# Altium project 2312_BadgePlaceTravail.PrjPcb (part 1 of 2)
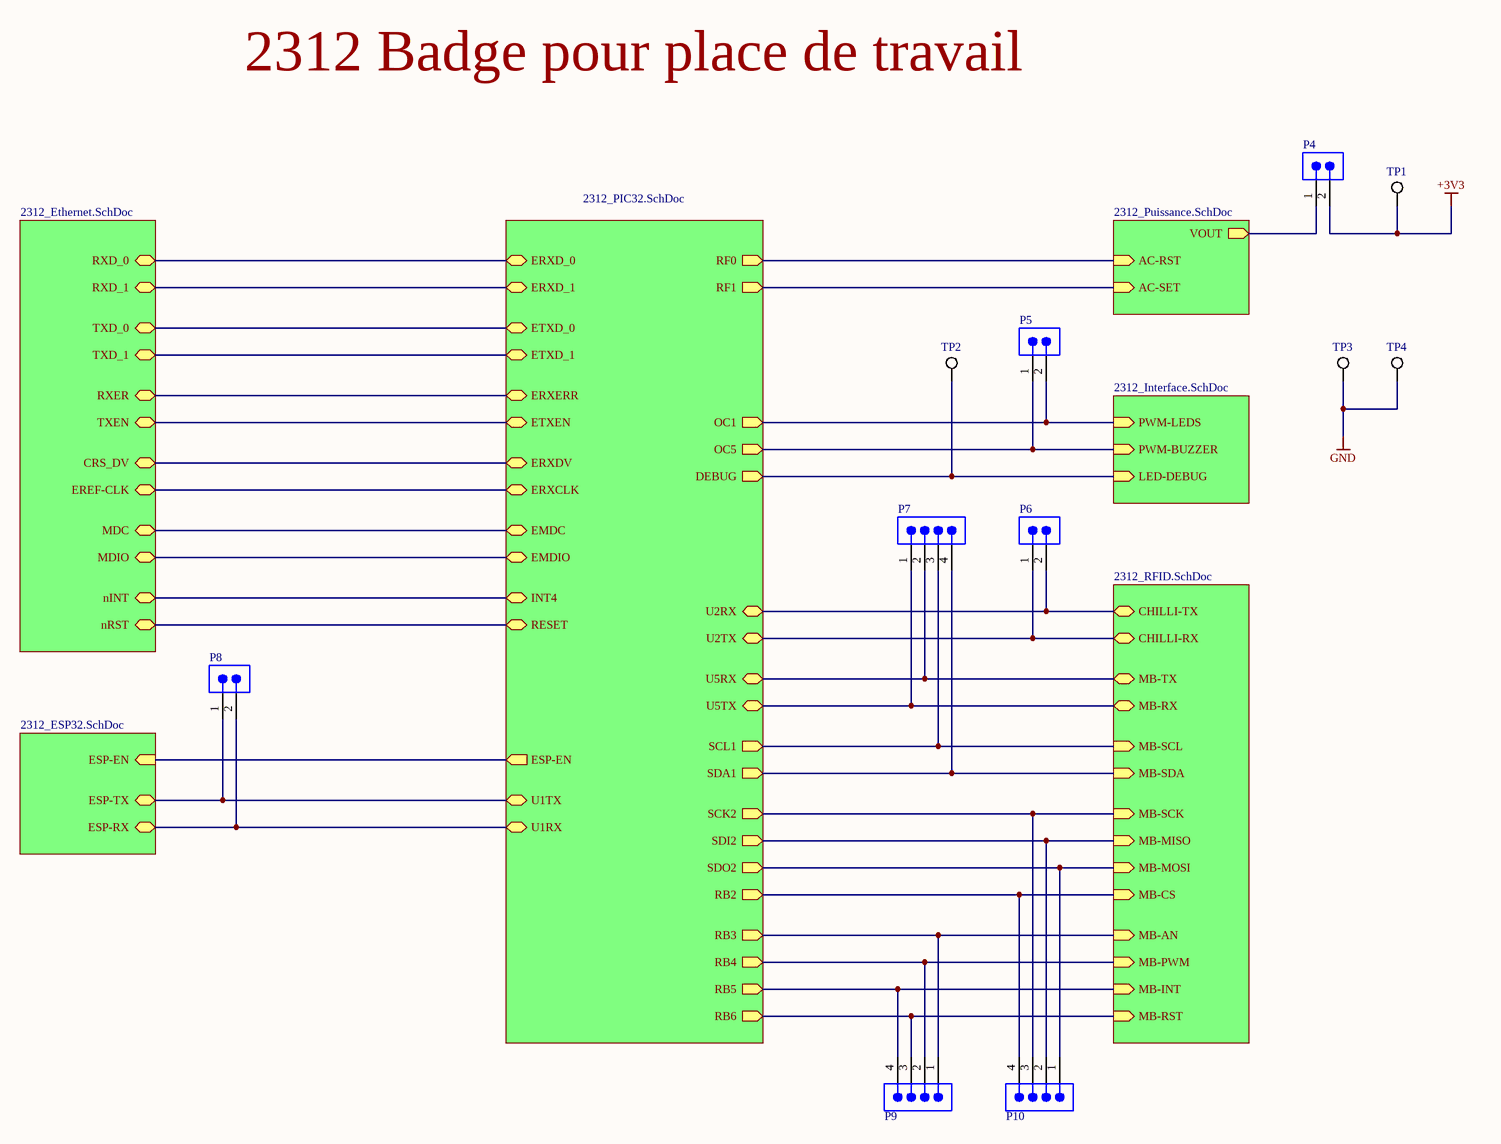
[diagram p0: 2312_SchemaBloc.SchDoc]
7 sheets, 119 parts. Net scope: hierarchical (ports join the sheet entries above them; power ports are global).
Board file: 2312_BadgePlaceTravail.PcbDoc
Sheets:
  2312_SchemaBloc.SchDoc
    Puissance = 2312_Puissance.SchDoc
    Microcontrôleur = 2312_PIC32.SchDoc
    Interface = 2312_Interface.SchDoc
    Ethernet = 2312_Ethernet.SchDoc
    Communication = 2312_RFID.SchDoc
    ESP32 = 2312_ESP32.SchDoc

## Sheet 2312_SchemaBloc.SchDoc
size A3; Author: Miguel Santos; Organization: ETML-ES; Address1: Avenue Recordon 1; Address2: 1004 Lausanne; Address3: Switzerland; SheetNumber: 1; SheetTotal: 7; Version: 1.0

### Parts
P4  61300211121  [61300211121]  (value not drawn)
P5  61300211121  [61300211121]  (value not drawn)
P6  61300211121  [61300211121]  (value not drawn)
P7  61300411121  [61300411121]  (value not drawn)
P8  61300211121  [61300211121]  (value not drawn)
P9  61300411121  [61300411121]  (value not drawn)
P10  61300411121  [61300411121]  (value not drawn)
TP1  5019  [KSTN-5019_V]  (value not drawn)
TP2  5019  [KSTN-5019_V]  (value not drawn)
TP3  5019  [KSTN-5019_V]  (value not drawn)
TP4  5019  [KSTN-5019_V]  (value not drawn)

### Sub-sheets
Communication = 2312_RFID.SchDoc: MB-AN (in), MB-RST (in), MB-CS (in), MB-SCK (in), MB-MISO (in), MB-MOSI (in), MB-PWM (in), MB-INT (in), MB-RX (bidir), MB-TX (bidir), MB-SCL (in), MB-SDA (in), CHILLI-RX (bidir), CHILLI-TX (bidir)
ESP32 = 2312_ESP32.SchDoc: ESP-RX (bidir), ESP-EN (in), ESP-TX (bidir)
Ethernet = 2312_Ethernet.SchDoc: CRS_DV (bidir), MDIO (bidir), MDC (bidir), nRST (bidir), RXER (bidir), RXD_0 (bidir), RXD_1 (bidir), nINT (bidir), TXEN (bidir), TXD_0 (bidir), TXD_1 (bidir), EREF-CLK (bidir)
Interface = 2312_Interface.SchDoc: PWM-BUZZER (in), PWM-LEDS (in), LED-DEBUG (in)
Microcontrôleur = 2312_PIC32.SchDoc: ETXEN (bidir), ETXD_0 (bidir), ETXD_1 (bidir), U5RX (bidir), U5TX (bidir), EMDC (bidir), U2RX (bidir), U2TX (bidir), SDA1 (out), SCL1 (out), INT4 (bidir), OC1 (out), EMDIO (bidir), U1RX (bidir), U1TX (bidir), OC5 (out), RF0 (out), RF1 (out), ERXD_1 (bidir), ERXD_0 (bidir), ERXDV (bidir), ERXERR (bidir), RB3 (out), RB4 (out), RB5 (out), RB6 (out), ESP-EN (out), RB2 (out), SCK2 (out), SDI2 (out), SDO2 (out), RESET (bidir), ERXCLK (bidir), DEBUG (out)
Puissance = 2312_Puissance.SchDoc: VOUT (out), AC-SET (in), AC-RST (in)

### Nets
+3V3: P4.2 TP1.1
GND: TP3.1 TP4.1
AC-RST: sheet Puissance/AC-RST, sheet Microcontrôleur/RF0
AC-SET: sheet Puissance/AC-SET, sheet Microcontrôleur/RF1
CHILLI-RX: P6.1 ; sheet Microcontrôleur/U2TX, sheet Communication/CHILLI-RX
CHILLI-TX: P6.2 ; sheet Microcontrôleur/U2RX, sheet Communication/CHILLI-TX
CRS_DV: sheet Microcontrôleur/ERXDV, sheet Ethernet/CRS_DV
DEBUG: TP2.1 ; sheet Microcontrôleur/DEBUG, sheet Interface/LED-DEBUG
EMDC: sheet Microcontrôleur/EMDC, sheet Ethernet/MDC
EMDIO: sheet Microcontrôleur/EMDIO, sheet Ethernet/MDIO
EN: sheet Microcontrôleur/ESP-EN, sheet ESP32/ESP-EN
EREF-CLK: sheet Microcontrôleur/ERXCLK, sheet Ethernet/EREF-CLK
ERXD_0: sheet Microcontrôleur/ERXD_0, sheet Ethernet/RXD_0
ERXD_1: sheet Microcontrôleur/ERXD_1, sheet Ethernet/RXD_1
ERXERR: sheet Microcontrôleur/ERXERR, sheet Ethernet/RXER
ETXD_0: sheet Microcontrôleur/ETXD_0, sheet Ethernet/TXD_0
ETXD_1: sheet Microcontrôleur/ETXD_1, sheet Ethernet/TXD_1
ETXEN: sheet Microcontrôleur/ETXEN, sheet Ethernet/TXEN
INT4: sheet Microcontrôleur/INT4, sheet Ethernet/nINT
IO6: P8.2 ; sheet Microcontrôleur/U1RX, sheet ESP32/ESP-RX
IO7: P8.1 ; sheet Microcontrôleur/U1TX, sheet ESP32/ESP-TX
MB-AN: P9.1 ; sheet Microcontrôleur/RB3, sheet Communication/MB-AN
MB-CS: P10.4 ; sheet Microcontrôleur/RB2, sheet Communication/MB-CS
MB-INT: P9.4 ; sheet Microcontrôleur/RB5, sheet Communication/MB-INT
MB-MISO: P10.2 ; sheet Microcontrôleur/SDI2, sheet Communication/MB-MISO
MB-MOSI: P10.1 ; sheet Microcontrôleur/SDO2, sheet Communication/MB-MOSI
MB-PWM: P9.2 ; sheet Microcontrôleur/RB4, sheet Communication/MB-PWM
MB-RST: P9.3 ; sheet Microcontrôleur/RB6, sheet Communication/MB-RST
MB-RX: P7.1 ; sheet Microcontrôleur/U5TX, sheet Communication/MB-RX
MB-SCK: P10.3 ; sheet Microcontrôleur/SCK2, sheet Communication/MB-SCK
MB-SCL: P7.3 ; sheet Microcontrôleur/SCL1, sheet Communication/MB-SCL
MB-SDA: P7.4 ; sheet Microcontrôleur/SDA1, sheet Communication/MB-SDA
MB-TX: P7.2 ; sheet Microcontrôleur/U5RX, sheet Communication/MB-TX
nRST: sheet Microcontrôleur/RESET, sheet Ethernet/nRST
OC1: P5.2 ; sheet Microcontrôleur/OC1, sheet Interface/PWM-LEDS
OC5: P5.1 ; sheet Microcontrôleur/OC5, sheet Interface/PWM-BUZZER
VOUT: P4.1 ; sheet Puissance/VOUT

### Notes on the sheet
- 2312 Badge pour place de travail
- Fichier :
- a
- Date :
- Heure :
- Version :
- Auteur :
- Modif.
- b
- c
- d
- Projet :
- No :
- Nb feuilles
- Feuille n°
- Chemin :

### Library data of the parts
P4-P6 P8 = 61300211121: WR-PHD Pin Header, THT, Vertical, pitch 2.54mm, 1 Row, 2P; Manufacturer: Wurth Elektronik; Contact Resistance: 20mΩ; Rated Current: 3A; Working Voltage: 250V; Withstanding Voltage: 500V; ComponentLink1Description: Website Link; ComponentLink1URL: https://www.we-online.com/redexpert/article/61300211121?ad; ComponentLink2Description: Datasheet Link; ComponentLink2URL: https://www.we-online.com/redexpert/spec/61300211121?ad; Manufacturer Part Number: 61300211121; Category: Board-to-Board Connectors; Match Code: WR-PHD; Mount: Through Hole; Operating Temperature Max: 105°C; Operating Temperature Min: -40°C; Packaging: Bag; Gender: Pin Header; Number of Pins: 2; Number of Rows: 1; Orientation: Vertical; Pitch: 2.54mm
P7 P9 P10 = 61300411121: WR-PHD Pin Header, THT, Vertical, pitch 2.54mm, 1 Row, 4P; Manufacturer: Wurth Elektronik; Contact Resistance: 20mΩ; Rated Current: 3A; Working Voltage: 250V; Withstanding Voltage: 500V; ComponentLink1Description: Website Link; ComponentLink1URL: https://www.we-online.com/redexpert/article/61300411121?ad; ComponentLink2Description: Datasheet Link; ComponentLink2URL: https://www.we-online.com/redexpert/spec/61300411121?ad; Manufacturer Part Number: 61300411121; Category: Board-to-Board Connectors; Match Code: WR-PHD; Mount: Through Hole; Operating Temperature Max: 105°C; Operating Temperature Min: -40°C; Packaging: Bag; Gender: Pin Header; Number of Pins: 4; Number of Rows: 1; Orientation: Vertical; Pitch: 2.54mm
TP1-TP4 = CMP-1672-00008-1: Test Point, 1 Position SMD, RoHS, Tape and Reel; ComponentLink1Description: Manufacturer URL; Package Quantity: 1000; DatasheetVersion: 03/2014; Packaging: Tape and Reel; ComponentLink2URL: http://www.keyelco.com/product-pdf.cfm?p=1357; ComponentLink1URL: http://www.keyelco.com/; Mount: Surface Mount; Contact Plating: Silver; PackageDescription: 1-Pin Surface Mount Device, Body 3.81 x 2.03 mm; Pins: 1; RoHSCompliant: True; Mounting Technology: Surface Mount; ComponentLink2Description: Datasheet; PackageReference: 5019

## Sheet 2312_Puissance.SchDoc
size A3; Author: Miguel Santos; Organization: ETML-ES; Address1: Avenue Recordon 1; Address2: 1004 Lausanne; Address3: Switzerland; SheetNumber: 2; SheetTotal: 7; Version: 1.0
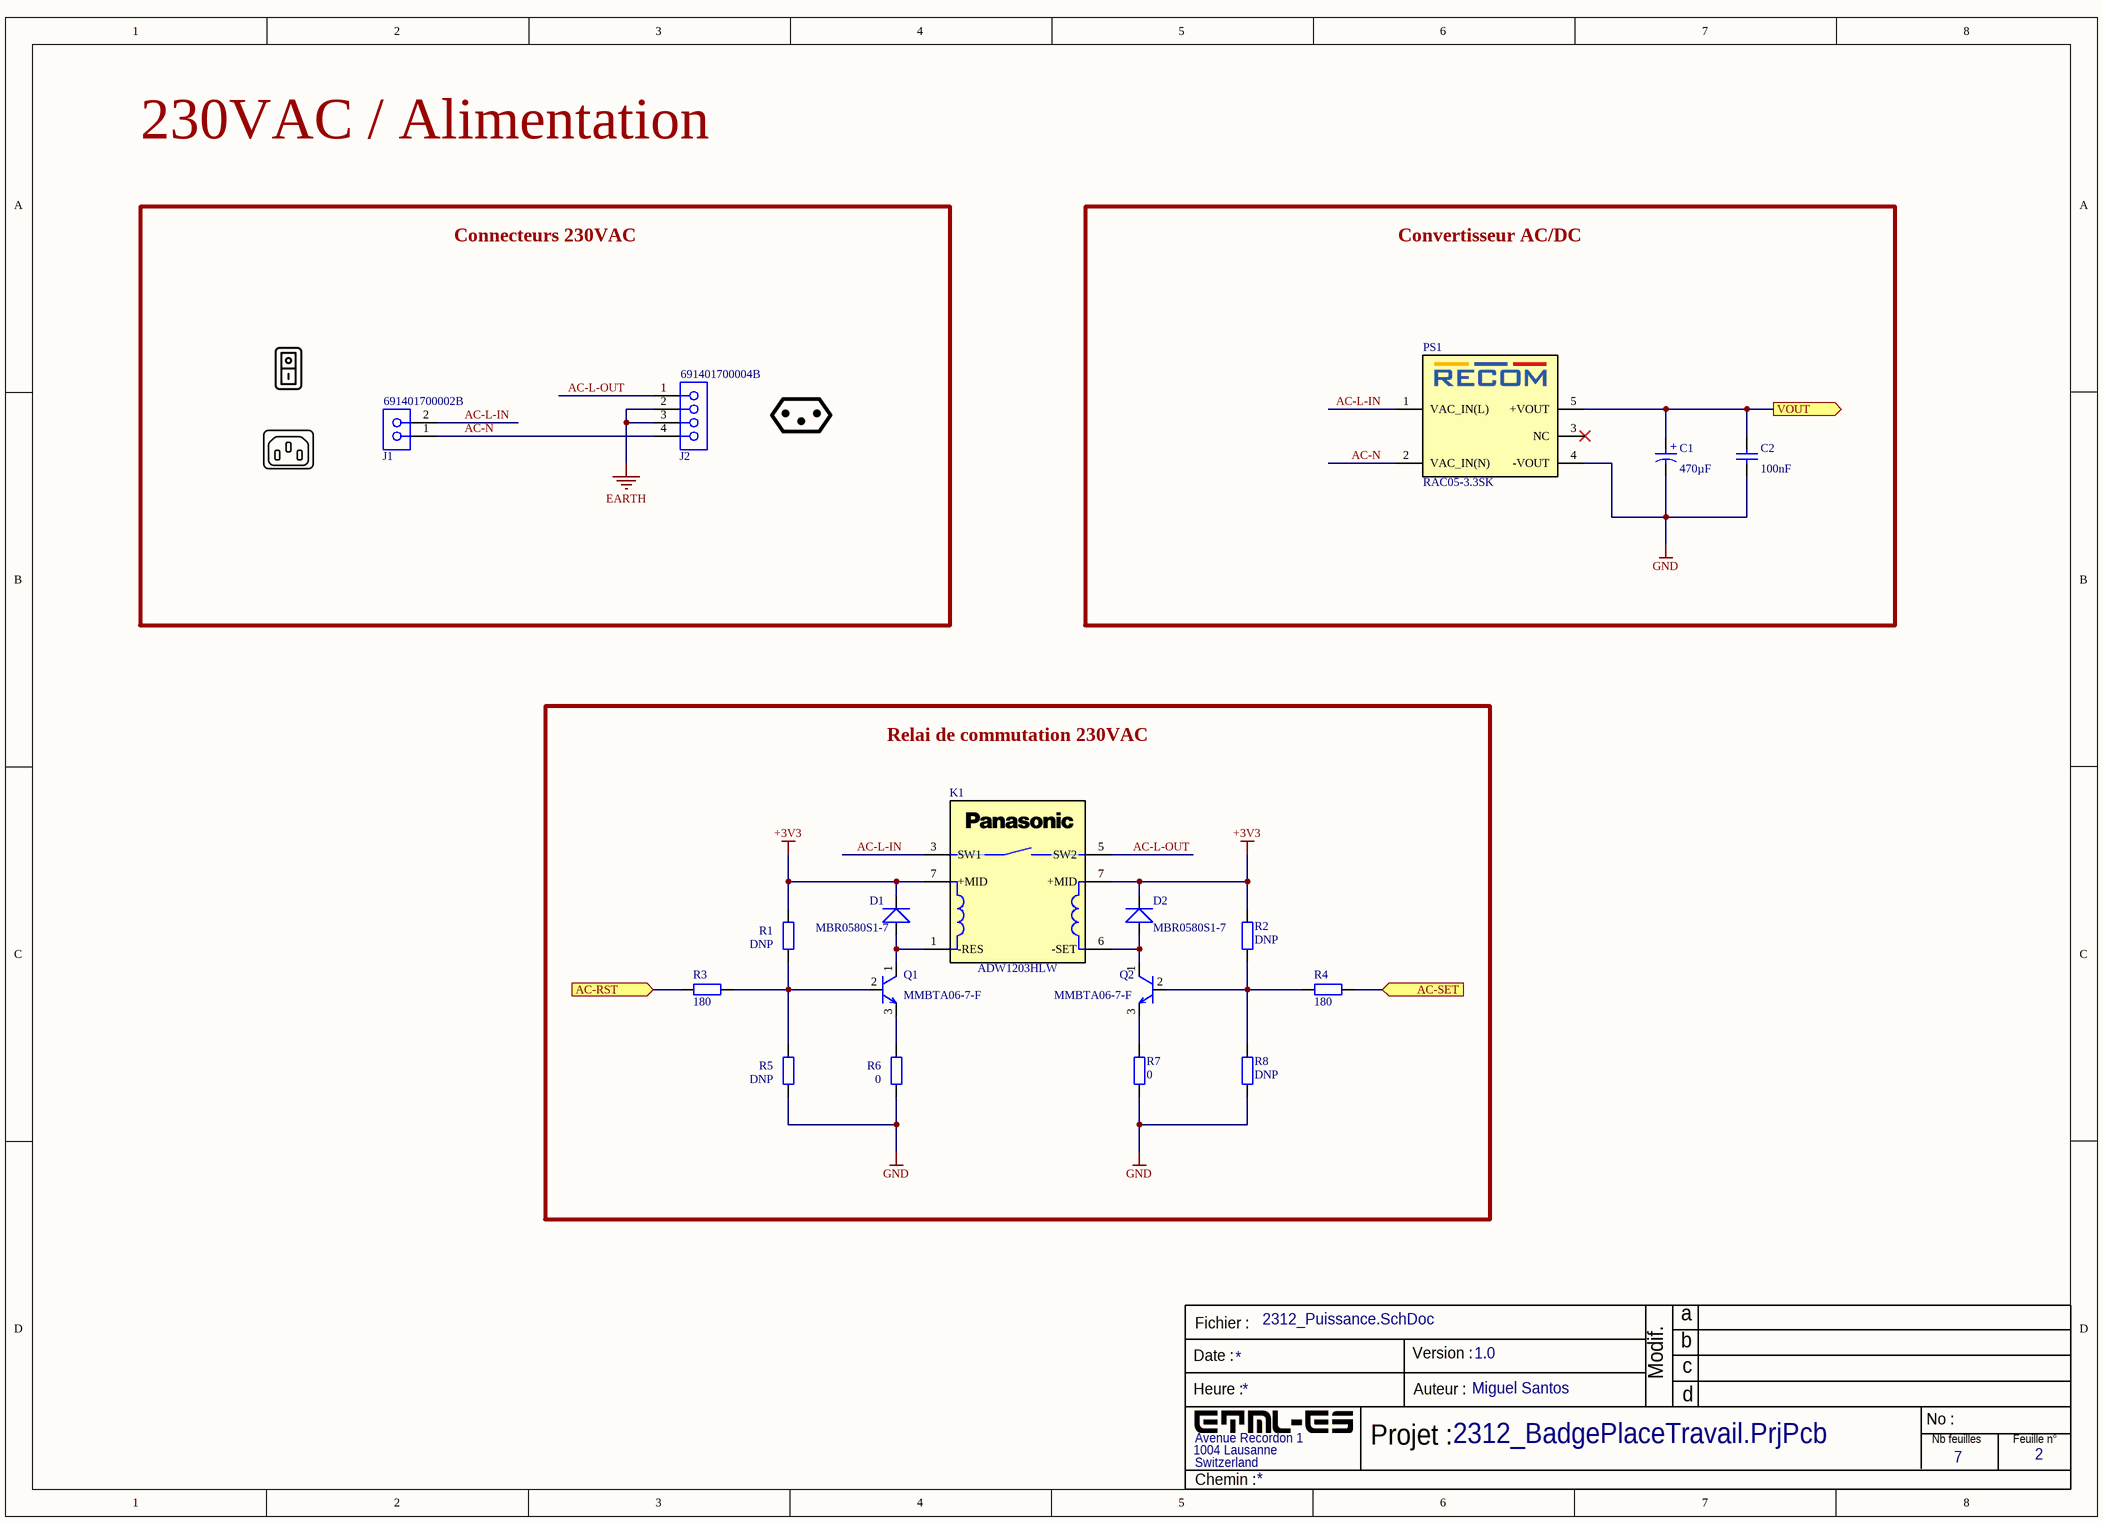
[diagram p1: 2312_Puissance.SchDoc]

### Parts
C1  Capacitance: 470µF  [WCAP-PSHP_D8H7.7]  (hidden comment: 875115150005)
C2  Capacitance: 100nF  [WCAP-CSGP_0805_L2W1.25H0.8_Reflow]  (hidden comment: 885012207016)
D1  MBR0580S1-7  [MBR0580S1-7_DIO-M]
D2  MBR0580S1-7  [MBR0580S1-7_DIO-M]
J1  691401700002B  [691401700002B]
J2  691401700004B  [691401700004B]
K1  ADW1203HLW  [ADW1203HLW]
PS1  RAC05-3.3SK  [CONV_RAC05-3.3SK]
Q1  MMBTA06-7-F  [SOT91P240X120-3N]
Q2  MMBTA06-7-F  [SOT91P240X120-3N]
R1  Resistance: DNP  [2312-RES-0805]  (hidden comment: RES-0805)
R2  Resistance: DNP  [2312-RES-0805]  (hidden comment: RES-0805)
R3  Resistance: 180  [2312-RES-0805]  (hidden comment: RES-0805)
R4  Resistance: 180  [2312-RES-0805]  (hidden comment: RES-0805)
R5  Resistance: DNP  [2312-RES-0805]  (hidden comment: RES-0805)
R6  Resistance: 0  [2312-RES-0805]  (hidden comment: RES-0805)
R7  Resistance: 0  [2312-RES-0805]  (hidden comment: RES-0805)
R8  Resistance: DNP  [2312-RES-0805]  (hidden comment: RES-0805)

### Blocks framed on the sheet
Connecteurs 230VAC: J1 J2
Convertisseur AC/DC: C1 C2 PS1
Relai de commutation 230VAC: D1 D2 K1 Q1 Q2 R1-R8

### Ports
AC-RST (in), AC-SET (in), VOUT (out)

### Nets
+3V3: D1.2 D2.2 K1.7(+MID) R1.2 R2.2
EARTH: J2.2 J2.3
GND: C1.2(N) C2.1 PS1.4(-VOUT) R5.1 R6.1 R7.1 R8.1
AC-L-IN: J1.2 K1.3(SW1) PS1.1(VAC_IN(L))
AC-L-OUT: J2.1 K1.5(SW2)
AC-N: J1.1 J2.4 PS1.2(VAC_IN(N))
AC-RST: R3.2 ; port AC-RST
AC-SET: R4.1 ; port AC-SET
VOUT: C1.1(P) C2.2 PS1.5(+VOUT) ; port VOUT
NetD1_1: D1.1 K1.1(-RES) Q1.1(COLLECTOR)
NetD2_1: D2.1 K1.6(-SET) Q2.1(COLLECTOR)
NetQ1_2: Q1.2(BASE) R1.1 R3.1 R5.2
NetQ1_3: Q1.3(EMITTER) R6.2
NetQ2_2: Q2.2(BASE) R2.1 R4.2 R8.2
NetQ2_3: Q2.3(EMITTER) R7.2

Not connected (* = marked no-connect by the designer): PS1 3(NC)*

### Notes on the sheet
- 230VAC / Alimentation
- Fichier :
- a
- Date :
- Heure :
- Version :
- Auteur :
- Modif.
- b
- c
- d
- Projet :
- No :
- Nb feuilles
- Feuille n°
- Chemin :
- (in symbol 875115150005) +

### Library data of the parts
C1 = 875115150005: WCAP-PSHP Aluminum Polymer Capacitor, V-Chip, SMT, D8 x H7.7mm, 470µF, 6.3V; Manufacturer: Wurth Elektronik; Capacitance Tolerance: +/-20%; Dissipation Factor: 8%; Endurance: 2000h; ESR: 20mΩ; Leakage Current: 592µA; Ripple Current: 3500mA; Technical Reference: PSEE077471M6R3DVCTDB000; Manufacturer Part Number: 875115150005; Category: Aluminum Polymer Capacitors; Match Code: WCAP-PSHP; ComponentLink1Description: Website Link; ComponentLink1URL: https://www.we-online.com/redexpert/article/875115150005?ad; ComponentLink2Description: Datasheet Link; ComponentLink2URL: https://www.we-online.com/redexpert/spec/875115150005?ad; Mount: Surface Mount; Operating Temperature Max: 105°C; Operating Temperature Min: -55°C; Packaging: Tape and Reel; Height: 7.7mm; Diameter: 8mm; Rated Voltage (DC): 6.3V
C2 = 885012207016: WCAP-CSGP Multilayer Ceramic Chip Capacitor, General Purpose, size 0805, X7R, 100nF, 10VDC; Manufacturer: Wurth Elektronik; Case/Size Code: 0805; Capacitance Tolerance: +/-10%; Dissipation Factor: 5%; Insulation Resistance: 5GΩ; Rated Voltage (DC): 10V; Technical Reference: X7R0805104K010DFCT10000; Manufacturer Part Number: 885012207016; Category: Multilayer Ceramic Chip Capacitors; Match Code: WCAP-CSGP; ComponentLink1Description: Website Link; ComponentLink1URL: https://www.we-online.com/redexpert/article/885012207016?ad; ComponentLink2Description: Datasheet Link; ComponentLink2URL: https://www.we-online.com/redexpert/spec/885012207016?ad; Mount: Surface Mount; Operating Temperature Max: 125°C; Operating Temperature Min: -55°C; Packaging: Tape and Reel; Length: 2mm; Width: 1.25mm; Height: 0.8mm; Ceramic Type: X7R
D1 D2 = MBR0580S1-7: Diode Shottky, 500mA, 80V; Mfr_Name: Diodes Inc; Digi-Key_Part_Number_3: MBR0580S1-7DIDKR-ND; Digi-Key_Part_Number_2: MBR0580S1-7DICT-ND; Digi-Key_Part_Number_1: MBR0580S1-7DITR-ND; RefDes: RefDes; Type: Type
J1 = 691401700002B: WR-TBL Series 401B Vertical Entry, THT, pitch 5mm, 2p; Manufacturer: Wurth Elektronik; Modularity: No; Rated Current: 10A; Working Voltage: 300V; ComponentLink1Description: Website Link; ComponentLink1URL: https://www.we-online.com/redexpert/article/691401700002B?ad; ComponentLink2Description: Datasheet Link; ComponentLink2URL: https://www.we-online.com/redexpert/spec/691401700002B?ad; Manufacturer Part Number: 691401700002B; Category: Terminal Blocks; Match Code: WR-TBL; Mount: Through Hole; Operating Temperature Max: 105°C; Operating Temperature Min: -40°C; Packaging: Box; Application: Screwless; Number of Pins: 2; Number of Rows: 1; Orientation: Vertical; Pitch: 5mm
J2 = 691401700004B: WR-TBL Series 401B Vertical Entry, THT, pitch 5mm, 4p; Manufacturer: Wurth Elektronik; Modularity: No; Rated Current: 10A; Working Voltage: 300V; ComponentLink1Description: Website Link; ComponentLink1URL: https://www.we-online.com/redexpert/article/691401700004B?ad; ComponentLink2Description: Datasheet Link; ComponentLink2URL: https://www.we-online.com/redexpert/spec/691401700004B?ad; Manufacturer Part Number: 691401700004B; Category: Terminal Blocks; Match Code: WR-TBL; Mount: Through Hole; Operating Temperature Max: 105°C; Operating Temperature Min: -40°C; Packaging: Box; Application: Screwless; Number of Pins: 4; Number of Rows: 1; Orientation: Vertical; Pitch: 5mm
K1 = ADW1203HLW: RELAY GEN PURPOSE SPST 16A 3V; Manufacturer: Panasonic Electric Works; Rated Current: 16A; Manufacturer Part Number: ADW1203HLW; Working Voltage: 3V
PS1 = RAC05-3.3SK: 5W AC/DC-Converter 'POWERLINE' 1x1 4kV reg; MF: Recom Power; Value: *; Package: DIP-5 Recom Power; MP: RAC05-3.3SK; Price: None; SnapEDA_Link: https://www.snapeda.com/parts/RAC05-3.3SK/Recom%20Power/view-part/2834355/?ref=snap; Availability: Unavailable
Q1 Q2 = MMBTA06LT3G: Bipolar (BJT) Transistor NPN 80V 500mA 100MHz 225mW Surface Mount SOT-23-3 (TO-236)
R1 R8 = RES-0805: SMD Resistor 0805, 1.4kΩ
R2 R5 = RES-0805: SMD Resistor 0805, DNP
R3 R4 = RES-0805: SMD Resistor 0805, 140Ω
R6 R7 = RES-0805: SMD Resistor 0805, 2Ω

## Sheet 2312_PIC32.SchDoc
size A3; Author: Miguel Santos; Organization: ETML-ES; Address1: Avenue Recordon 1; Address2: 1004 Lausanne; Address3: Switzerland; SheetNumber: 3; SheetTotal: 7; Version: 1.0
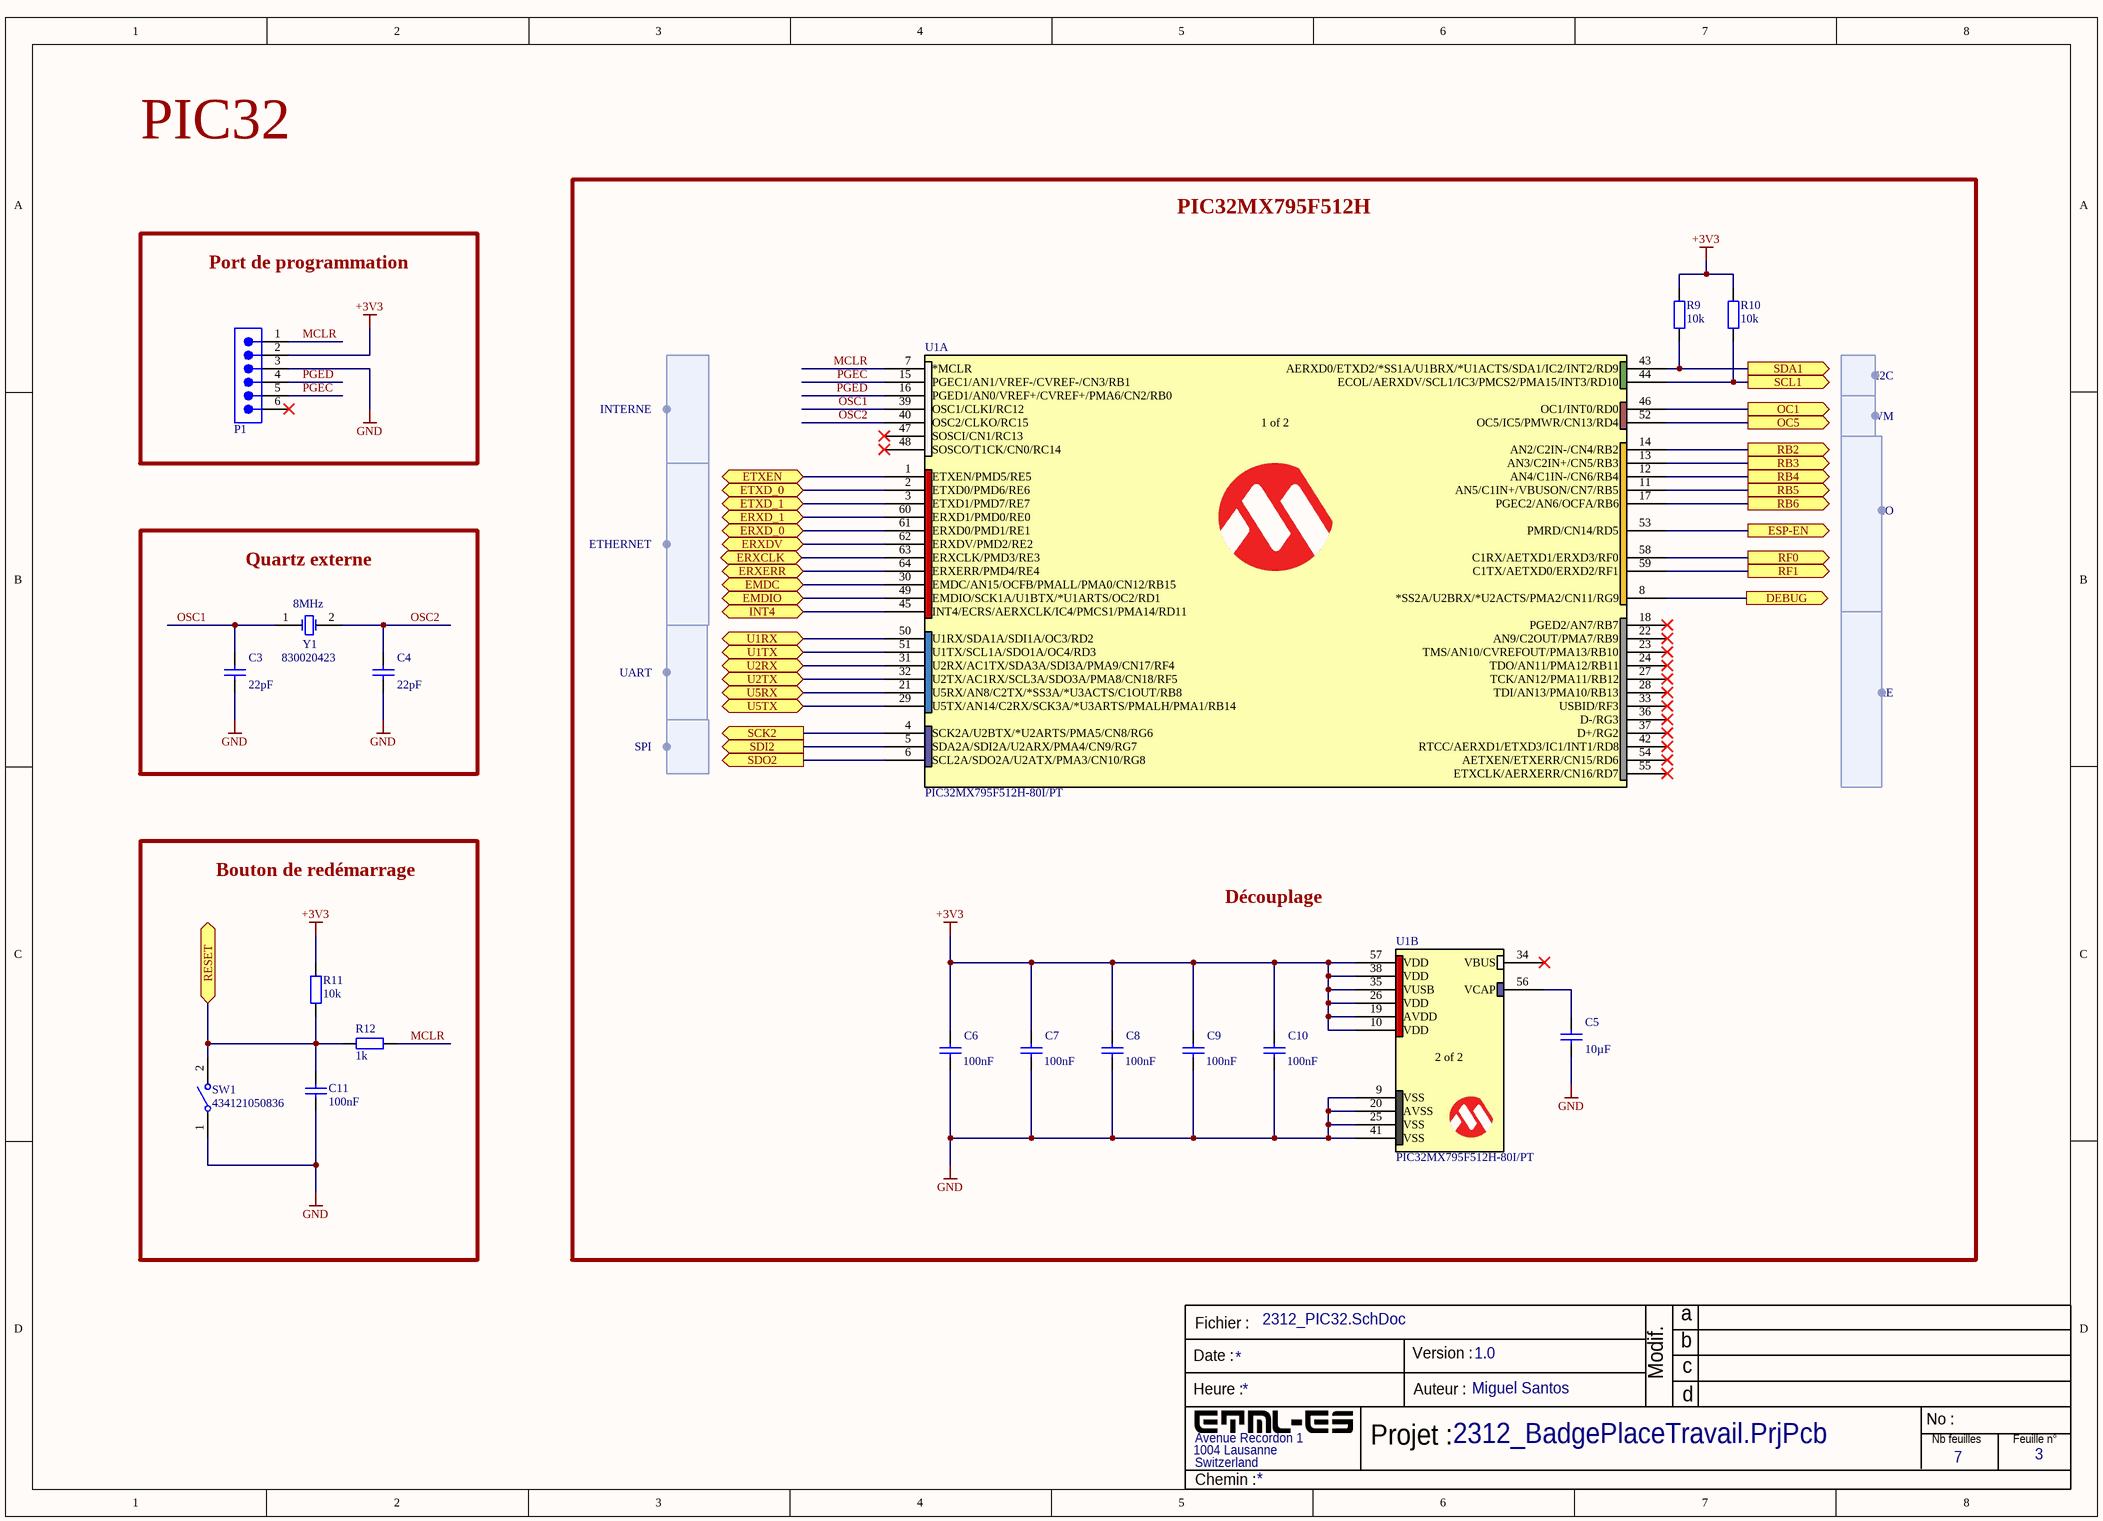
[diagram p2: 2312_PIC32.SchDoc]

### Parts
C3  Capacitance: 22pF  [WCAP-CSGP_0805_L2W1.25H0.6_Reflow]  (hidden comment: 885012007002)
C4  Capacitance: 22pF  [WCAP-CSGP_0805_L2W1.25H0.6_Reflow]  (hidden comment: 885012007002)
C5  Capacitance: 10µF  [WCAP-CSGP_0805_L2W1.25H1.25]  (hidden comment: 885012207003)
C6  Capacitance: 100nF  [WCAP-CSGP_0805_L2W1.25H0.8_Reflow]  (hidden comment: 885012207016)
C7  Capacitance: 100nF  [WCAP-CSGP_0805_L2W1.25H0.8_Reflow]  (hidden comment: 885012207016)
C8  Capacitance: 100nF  [WCAP-CSGP_0805_L2W1.25H0.8_Reflow]  (hidden comment: 885012207016)
C9  Capacitance: 100nF  [WCAP-CSGP_0805_L2W1.25H0.8_Reflow]  (hidden comment: 885012207016)
C10  Capacitance: 100nF  [WCAP-CSGP_0805_L2W1.25H0.8_Reflow]  (hidden comment: 885012207016)
C11  Capacitance: 100nF  [WCAP-CSGP_0805_L2W1.25H0.8_Reflow]  (hidden comment: 885012207016)
P1  61300611121  [61300611121]  (value not drawn)
R9  Resistance: 10k  [2312-RES-0805]  (hidden comment: RES-0805)
R10  Resistance: 10k  [2312-RES-0805]  (hidden comment: RES-0805)
R11  Resistance: 10k  [2312-RES-0805]  (hidden comment: RES-0805)
R12  Resistance: 1k  [2312-RES-0805]  (hidden comment: RES-0805)
SW1  434121050836  [WS-TASV_L6W3.5H5_4341x10508x6]
U1  PIC32MX795F512H-80I/PT  [TQFP64_10x10MC_MCH]  (parts A,B of 2)
Y1  830020423  Frequency: 8MHz  [WE-XTAL_HC49/4HSMX]

### Blocks framed on the sheet
PIC32MX795F512H: C5-C10 R9 R10 U1
Port de programmation: P1
Quartz externe: C3 C4 Y1
Bouton de redémarrage: C11 R11 R12 SW1

### Ports
DEBUG (out), EMDC (bidir), EMDIO (bidir), ERXCLK (bidir), ERXD_0 (bidir), ERXD_1 (bidir), ERXDV (bidir), ERXERR (bidir), ESP-EN (out), ETXD_0 (bidir), ETXD_1 (bidir), ETXEN (bidir), INT4 (bidir), OC1 (out), OC5 (out), RB2 (out), RB3 (out), RB4 (out), RB5 (out), RB6 (out), RESET (bidir), RF0 (out), RF1 (out), SCK2 (out), SCL1 (out), SDA1 (out), SDI2 (out), SDO2 (out), U1RX (bidir), U1TX (bidir), U2RX (bidir), U2TX (bidir), U5RX (bidir), U5TX (bidir)

### Harnesses
?: 

### Nets
+3V3: C6.2 C7.2 C8.2 C9.2 C10.2 P1.2 R9.2 R10.1 R11.1 U1.10(VDD) U1.19(AVDD) U1.26(VDD) U1.35(VUSB) U1.38(VDD) U1.57(VDD)
GND: C3.1 C4.2 C5.1 C6.1 C7.1 C8.1 C9.1 C10.1 C11.2 P1.3 SW1.1 U1.9(VSS) U1.20(AVSS) U1.25(VSS) U1.41(VSS)
AC-RST: U1.58(C1RX/AETXD1/ERXD3/RF0) ; port RF0
AC-SET: U1.59(C1TX/AETXD0/ERXD2/RF1) ; port RF1
CHILLI-RX: U1.32(U2TX/AC1RX/SCL3A/SDO3A/PMA8/CN18/RF5) ; port U2TX
CHILLI-TX: U1.31(U2RX/AC1TX/SDA3A/SDI3A/PMA9/CN17/RF4) ; port U2RX
CRS_DV: U1.62(ERXDV/PMD2/RE2) ; port ERXDV
DEBUG: U1.8(*SS2A/U2BRX/*U2ACTS/PMA2/CN11/RG9) ; port DEBUG
EMDC: U1.30(EMDC/AN15/OCFB/PMALL/PMA0/CN12/RB15) ; port EMDC
EMDIO: U1.49(EMDIO/SCK1A/U1BTX/*U1ARTS/OC2/RD1) ; port EMDIO
EN: U1.53(PMRD/CN14/RD5) ; port ESP-EN
EREF-CLK: U1.63(ERXCLK/PMD3/RE3) ; port ERXCLK
ERXD_0: U1.61(ERXD0/PMD1/RE1) ; port ERXD_0
ERXD_1: U1.60(ERXD1/PMD0/RE0) ; port ERXD_1
ERXERR: U1.64(ERXERR/PMD4/RE4) ; port ERXERR
ETXD_0: U1.2(ETXD0/PMD6/RE6) ; port ETXD_0
ETXD_1: U1.3(ETXD1/PMD7/RE7) ; port ETXD_1
ETXEN: U1.1(ETXEN/PMD5/RE5) ; port ETXEN
INT4: U1.45(INT4/ECRS/AERXCLK/IC4/PMCS1/PMA14/RD11) ; port INT4
IO6: U1.50(U1RX/SDA1A/SDI1A/OC3/RD2) ; port U1RX
IO7: U1.51(U1TX/SCL1A/SDO1A/OC4/RD3) ; port U1TX
MB-AN: U1.13(AN3/C2IN+/CN5/RB3) ; port RB3
MB-CS: U1.14(AN2/C2IN-/CN4/RB2) ; port RB2
MB-INT: U1.11(AN5/C1IN+/VBUSON/CN7/RB5) ; port RB5
MB-MISO: U1.5(SDA2A/SDI2A/U2ARX/PMA4/CN9/RG7) ; port SDI2
MB-MOSI: U1.6(SCL2A/SDO2A/U2ATX/PMA3/CN10/RG8) ; port SDO2
MB-PWM: U1.12(AN4/C1IN-/CN6/RB4) ; port RB4
MB-RST: U1.17(PGEC2/AN6/OCFA/RB6) ; port RB6
MB-RX: U1.29(U5TX/AN14/C2RX/SCK3A/*U3ARTS/PMALH/PMA1/RB14) ; port U5TX
MB-SCK: U1.4(SCK2A/U2BTX/*U2ARTS/PMA5/CN8/RG6) ; port SCK2
MB-SCL: R10.2 U1.44(ECOL/AERXDV/SCL1/IC3/PMCS2/PMA15/INT3/RD10) ; port SCL1
MB-SDA: R9.1 U1.43(AERXD0/ETXD2/*SS1A/U1BRX/*U1ACTS/SDA1/IC2/INT2/RD9) ; port SDA1
MB-TX: U1.21(U5RX/AN8/C2TX/*SS3A/*U3ACTS/C1OUT/RB8) ; port U5RX
MCLR: P1.1 R12.2 U1.7(*MCLR)
nRST: C11.1 R11.2 R12.1 SW1.2 ; port RESET
OC1: U1.46(OC1/INT0/RD0) ; port OC1
OC5: U1.52(OC5/IC5/PMWR/CN13/RD4) ; port OC5
OSC1: C3.2 U1.39(OSC1/CLKI/RC12) Y1.1(OSC1)
OSC2: C4.1 U1.40(OSC2/CLKO/RC15) Y1.2(OSC2)
PGEC: P1.5 U1.15(PGEC1/AN1/VREF-/CVREF-/CN3/RB1)
PGED: P1.4 U1.16(PGED1/AN0/VREF+/CVREF+/PMA6/CN2/RB0)
NetC5_2: C5.2 U1.56(VCAP)

Not connected (* = marked no-connect by the designer): P1 6*; U1 18(PGED2/AN7/RB7)* 22(AN9/C2OUT/PMA7/RB9)* 23(TMS/AN10/CVREFOUT/PMA13/RB10)* 24(TDO/AN11/PMA12/RB11)* 27(TCK/AN12/PMA11/RB12)* 28(TDI/AN13/PMA10/RB13)* 33(USBID/RF3)* 34(VBUS)* 36(D-/RG3)* 37(D+/RG2)* 42(RTCC/AERXD1/ETXD3/IC1/INT1/RD8)* 47(SOSCI/CN1/RC13)* 48(SOSCO/T1CK/CN0/RC14)* 54(AETXEN/ETXERR/CN15/RD6)* 55(ETXCLK/AERXERR/CN16/RD7)*

### Notes on the sheet
- PIC32
- I2C
- INTERNE
- PWM
- GPIO
- ETHERNET
- UART
- LIBRE
- SPI
- Découplage
- Fichier :
- a
- Date :
- Heure :
- Version :
- Auteur :
- Modif.
- b
- c
- d
- Projet :
- No :
- Nb feuilles
- Feuille n°
- Chemin :
- (in symbol PIC32MX795F512H-80I/PT, part A) 1 of 2
- (in symbol PIC32MX795F512H-80I/PT, part B) 2 of 2

### Library data of the parts
C3 C4 = 885012007002: WCAP-CSGP Multilayer Ceramic Chip Capacitor, General Purpose, size 0805, NP0, 22pF, 10VDC; Manufacturer: Wurth Elektronik; Case/Size Code: 0805; Capacitance Tolerance: +/-5%; Insulation Resistance: 10GΩ; Q Factor: 840; Rated Voltage (DC): 10V; Technical Reference: NP00805220J010DFCT10000; Manufacturer Part Number: 885012007002; Category: Multilayer Ceramic Chip Capacitors; Match Code: WCAP-CSGP; ComponentLink1Description: Website Link; ComponentLink1URL: https://www.we-online.com/redexpert/article/885012007002?ad; ComponentLink2Description: Datasheet Link; ComponentLink2URL: https://www.we-online.com/redexpert/spec/885012007002?ad; Mount: Surface Mount; Operating Temperature Max: 125°C; Operating Temperature Min: -55°C; Packaging: Tape and Reel; Length: 2mm; Width: 1.25mm; Height: 0.6mm; Ceramic Type: NP0
C5 = 885012207003: WCAP-CSGP Multilayer Ceramic Chip Capacitor, General Purpose, size 0805, X7R, 10µF, 6.3VDC; Manufacturer: Wurth Elektronik; Case/Size Code: 0805; Capacitance Tolerance: +/-10%; Dissipation Factor: 10%; Insulation Resistance: 0.01GΩ; Rated Voltage (DC): 6.3V; Technical Reference: X7R0805106K6R3DFCT10000; Manufacturer Part Number: 885012207003; Category: Multilayer Ceramic Chip Capacitors; Match Code: WCAP-CSGP; ComponentLink1Description: Website Link; ComponentLink1URL: https://www.we-online.com/redexpert/article/885012207003?ad; ComponentLink2Description: Datasheet Link; ComponentLink2URL: https://www.we-online.com/redexpert/spec/885012207003?ad; Mount: Surface Mount; Operating Temperature Max: 125°C; Operating Temperature Min: -55°C; Packaging: Tape and Reel; Length: 2mm; Width: 1.25mm; Height: 1.25mm; Ceramic Type: X7R
C6-C11 = 885012207016: as C2 on sheet 2312_Puissance; Manufacturer Part Number: 885012207016; Category: Multilayer Ceramic Chip Capacitors; Match Code: WCAP-CSGP; ComponentLink1Description: Website Link; ComponentLink1URL: https://www.we-online.com/redexpert/article/885012207016?ad; ComponentLink2Description: Datasheet Link; ComponentLink2URL: https://www.we-online.com/redexpert/spec/885012207016?ad; Mount: Surface Mount; Operating Temperature Max: 125°C; Operating Temperature Min: -55°C; Packaging: Tape and Reel; Length: 2mm; Width: 1.25mm; Height: 0.8mm; Ceramic Type: X7R
P1 = 61300611121: WR-PHD Pin Header, THT, Vertical, pitch 2.54mm, 1 Row, 6P; Manufacturer: Wurth Elektronik; Contact Resistance: 20mΩ; Rated Current: 3A; Working Voltage: 250V; Withstanding Voltage: 500V; ComponentLink1Description: Website Link; ComponentLink1URL: https://www.we-online.com/redexpert/article/61300611121?ad; ComponentLink2Description: Datasheet Link; ComponentLink2URL: https://www.we-online.com/redexpert/spec/61300611121?ad; Manufacturer Part Number: 61300611121; Category: Board-to-Board Connectors; Match Code: WR-PHD; Mount: Through Hole; Operating Temperature Max: 105°C; Operating Temperature Min: -40°C; Packaging: Bag; Gender: Pin Header; Number of Pins: 6; Number of Rows: 1; Orientation: Vertical; Pitch: 2.54mm
R9-R11 = RES-0805: SMD Resistor 0805, 10kΩ
R12 = RES-0805: SMD Resistor 0805, 1kΩ
SW1 = 434121050836: WS-TASV SMT Tact Switch, L6 x W3.5 x H5mm, 360g, SPST-NO, 12V, 50mA; Manufacturer: Wurth Elektronik; Washable: No; Manufacturer Part Number: 434121050836; Category: Tact Switches; Match Code: WS-TASV; ComponentLink1Description: Website Link; ComponentLink1URL: https://www.we-online.com/redexpert/article/434121050836?ad; ComponentLink2Description: Datasheet Link; ComponentLink2URL: https://www.we-online.com/redexpert/spec/434121050836?ad; Mount: Surface Mount; Operating Temperature Max: 85°C; Operating Temperature Min: -40°C; Packaging: Tape and Reel; Length: 6mm; Width: 3.5mm; Height: 5mm; Circuit: SPST-NO; Contact Material: Stainless Steel; Contact Plating: Silver; Operation Force: 360g; Rated Current: 50mA; Rated Voltage (DC): 12V; Terminal Material: Copper Alloy; Terminal Plating: Silver
U1 = PIC32MX795F512H-80I/PT: No Description Available; Mfr_Name: Microchip; RefDes: RefDes; Type: Type
Y1 = 830020423: WE-XTAL Quartz Crystal, SMT, HC49/4HSMX, 8MHz, +/-30ppm; Manufacturer: Wurth Elektronik; Frequency Stability: +/-50ppm; Load Capacitance: 18pF; ComponentLink1Description: Website Link; ComponentLink1URL: https://www.we-online.com/redexpert/article/830020423?ad; ComponentLink2Description: Datasheet Link; ComponentLink2URL: https://www.we-online.com/redexpert/spec/830020423?ad; Manufacturer Part Number: 830020423; Category: Crystals; Match Code: WE-XTAL; Mount: Surface Mount; Operating Temperature Max: 70°C; Operating Temperature Min: -20°C; Packaging: Tape and Reel; Case/Size Code: HC49/4HSMX; Length: 11.4mm; Width: 4.9mm; Height: 4.3mm; Frequency Tolerance: +/-30ppm

## Sheet 2312_Interface.SchDoc
size A3; Author: Miguel Santos; Organization: ETML-ES; Address1: Avenue Recordon 1; Address2: 1004 Lausanne; Address3: Switzerland; SheetNumber: 7; SheetTotal: 7; Version: 1.0
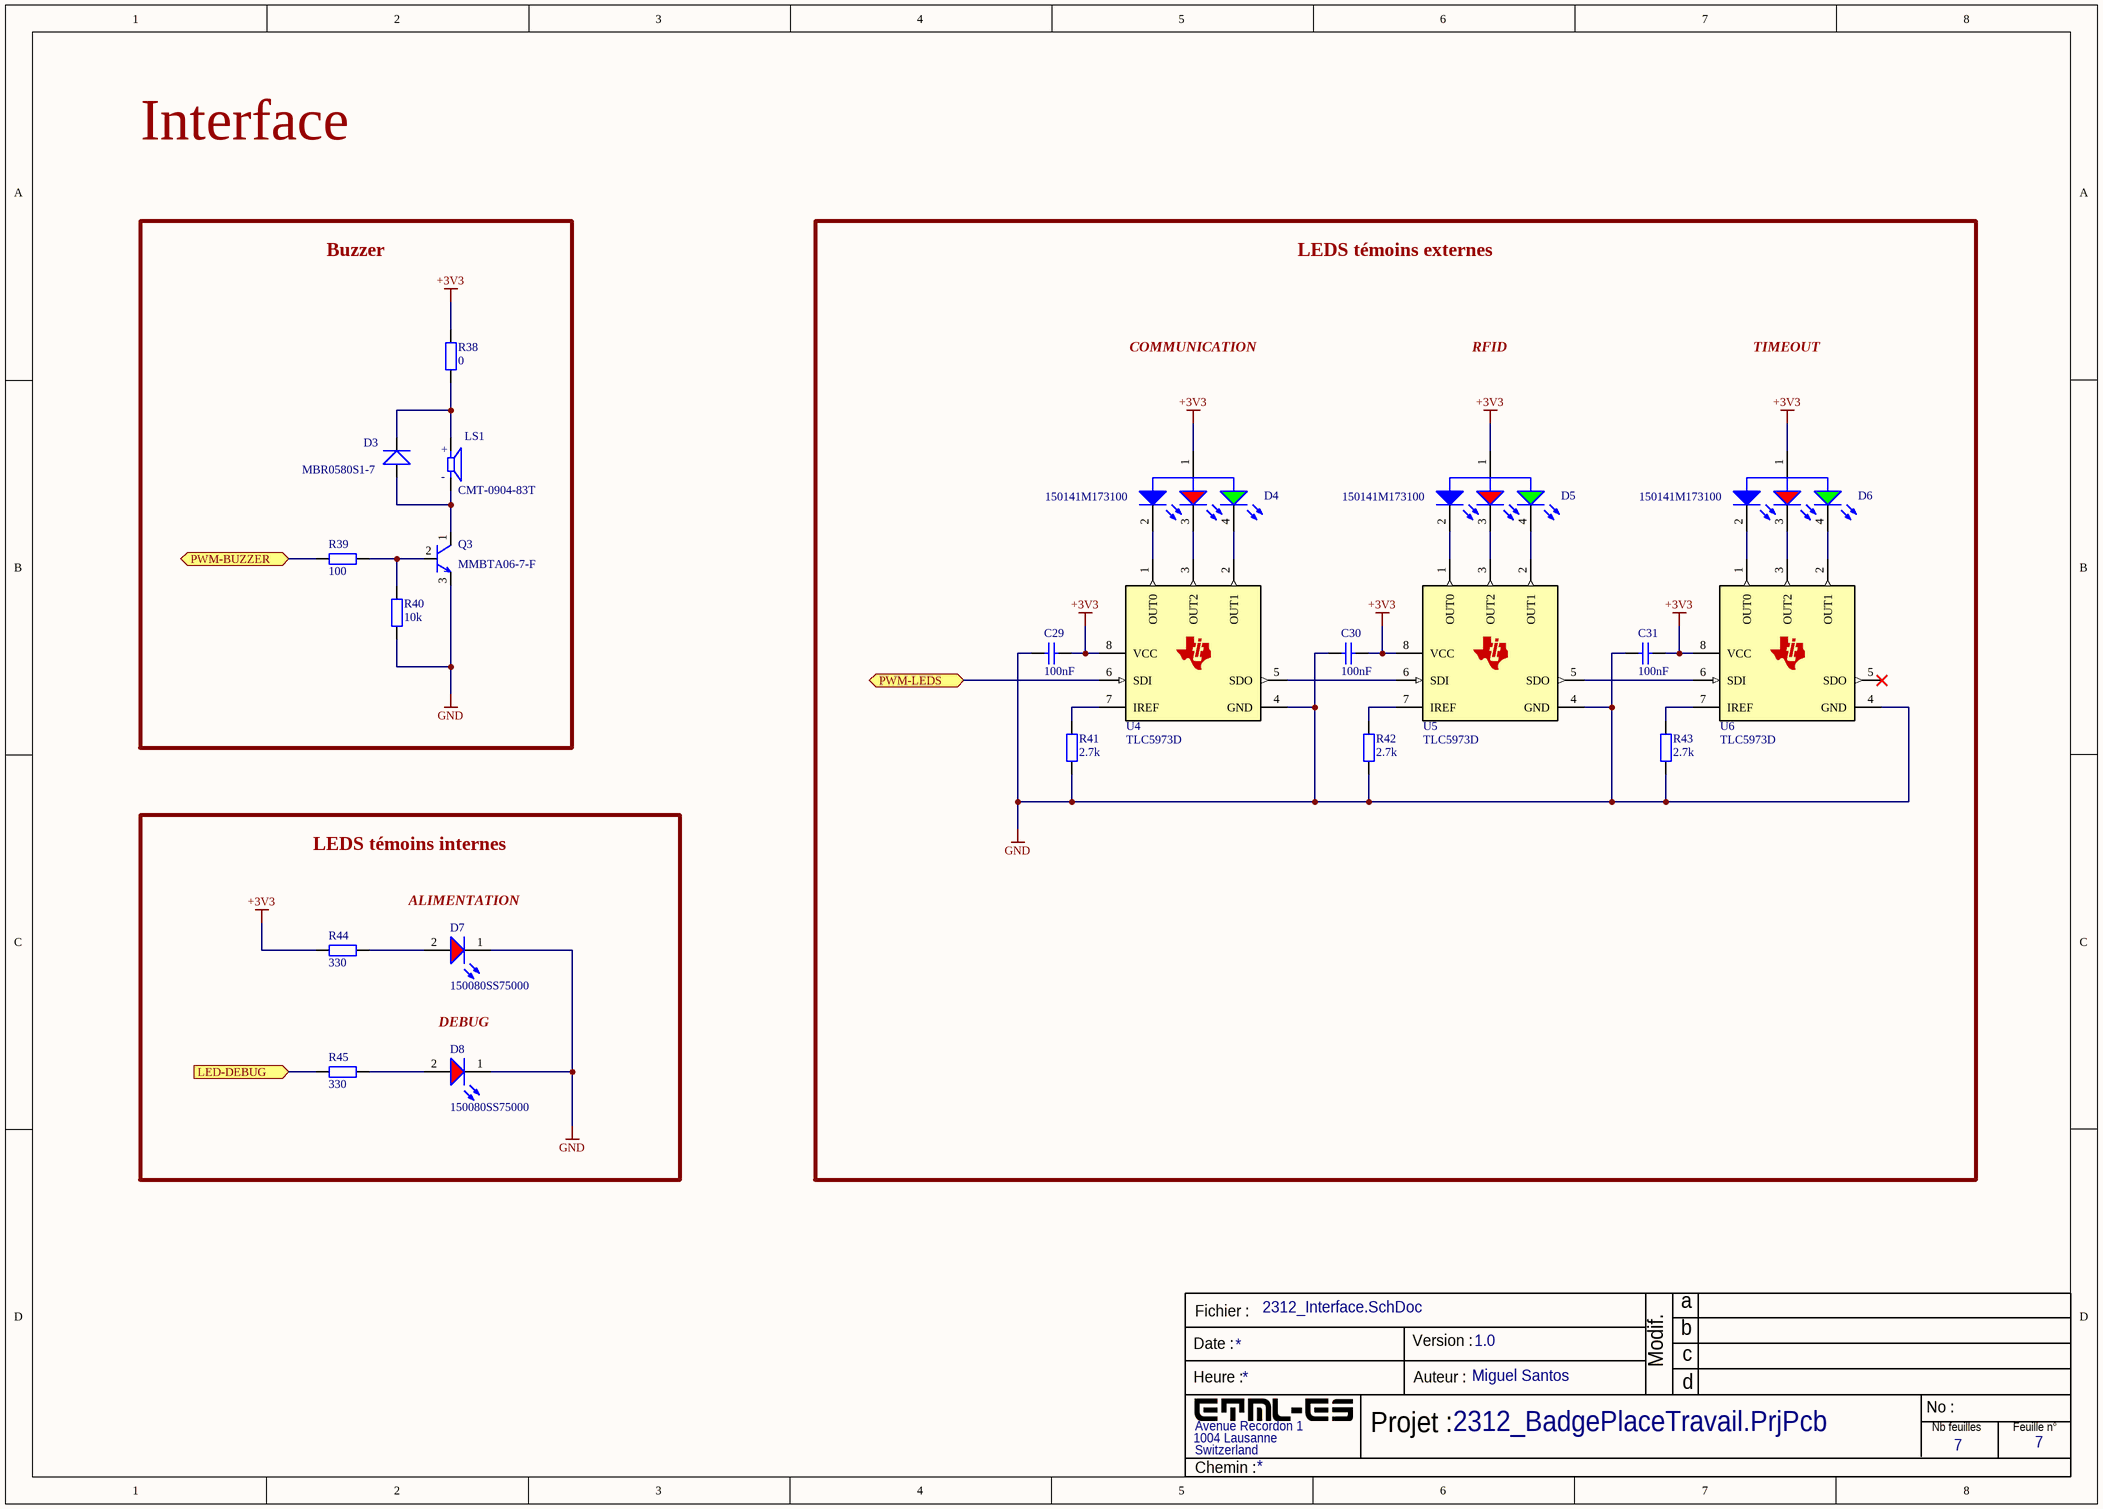
[diagram p3: 2312_Interface.SchDoc]

### Parts
C29  Capacitance: 100nF  [WCAP-CSGP_0805_L2W1.25H0.8_Reflow]  (hidden comment: 885012207016)
C30  Capacitance: 100nF  [WCAP-CSGP_0805_L2W1.25H0.8_Reflow]  (hidden comment: 885012207016)
C31  Capacitance: 100nF  [WCAP-CSGP_0805_L2W1.25H0.8_Reflow]  (hidden comment: 885012207016)
D3  MBR0580S1-7  [MBR0580S1-7_DIO]
D4  150141M173100  [WL-SFTW_3528_150141M173100]
D5  150141M173100  [WL-SFTW_3528_150141M173100]
D6  150141M173100  [WL-SFTW_3528_150141M173100]
D7  150080SS75000  [WL-SMCW_0805_150080xx75000]
D8  150080SS75000  [WL-SMCW_0805_150080xx75000]
LS1  CMT-0904-83T  [XDCR_CMT-0904-83T]
Q3  MMBTA06-7-F  [SOT91P240X120-3N]
R38  Resistance: 0  [2312-RES-0805]  (hidden comment: RES-0805)
R39  Resistance: 100  [2312-RES-0805]  (hidden comment: RES-0805)
R40  Resistance: 10k  [2312-RES-0805]  (hidden comment: RES-0805)
R41  Resistance: 2.7k  [2312-RES-0805]  (hidden comment: RES-0805)
R42  Resistance: 2.7k  [2312-RES-0805]  (hidden comment: RES-0805)
R43  Resistance: 2.7k  [2312-RES-0805]  (hidden comment: RES-0805)
R44  Resistance: 330  [2312-RES-0805]  (hidden comment: RES-0805)
R45  Resistance: 330  [2312-RES-0805]  (hidden comment: RES-0805)
U4  TLC5973D  [D0008A_M]
U5  TLC5973D  [D0008A_M]
U6  TLC5973D  [D0008A_M]

### Blocks framed on the sheet
Buzzer: D3 LS1 Q3 R38-R40
LEDS témoins externes: C29-C31 D4-D6 R41-R43 U4-U6
LEDS témoins internes: D7 D8 R44 R45

### Ports
LED-DEBUG (in), PWM-BUZZER (bidir), PWM-LEDS (bidir)

### Nets
+3V3: C29.2 C30.2 C31.2 D4.1(A) D5.1(A) D6.1(A) R38.2 R44.1 U4.8(VCC) U5.8(VCC) U6.8(VCC)
GND: C29.1 C30.1 C31.1 D7.1(K) D8.1(K) Q3.3(EMITTER) R40.2 R41.1 R42.1 R43.1 U4.4(GND) U5.4(GND) U6.4(GND)
DEBUG: R45.1 ; port LED-DEBUG
OC1: U4.6(SDI) ; port PWM-LEDS
OC5: R39.2 ; port PWM-BUZZER
NetD3_1: D3.1 LS1.N Q3.1(COLLECTOR)
NetD3_2: D3.2 LS1.P R38.1
NetD4_2: D4.2(K) U4.1(OUT0)
NetD4_3: D4.3(K) U4.3(OUT2)
NetD4_4: D4.4(K) U4.2(OUT1)
NetD5_2: D5.2(K) U5.1(OUT0)
NetD5_3: D5.3(K) U5.3(OUT2)
NetD5_4: D5.4(K) U5.2(OUT1)
NetD6_2: D6.2(K) U6.1(OUT0)
NetD6_3: D6.3(K) U6.3(OUT2)
NetD6_4: D6.4(K) U6.2(OUT1)
NetD7_2: D7.2(A) R44.2
NetD8_2: D8.2(A) R45.2
NetQ3_2: Q3.2(BASE) R39.1 R40.1
NetR41_2: R41.2 U4.7(IREF)
NetR42_2: R42.2 U5.7(IREF)
NetR43_2: R43.2 U6.7(IREF)
NetU4_5: U4.5(SDO) U5.6(SDI)
NetU5_5: U5.5(SDO) U6.6(SDI)

Not connected (* = marked no-connect by the designer): U6 5(SDO)*

### Notes on the sheet
- Interface
- COMMUNICATION
- RFID
- TIMEOUT
- (near D7) ALIMENTATION
- DEBUG
- Fichier :
- a
- Date :
- Heure :
- Version :
- Auteur :
- Modif.
- b
- c
- d
- Projet :
- No :
- Nb feuilles
- Feuille n°
- Chemin :
- (in symbol CMT-0904-83T) +; -

### Library data of the parts
C29-C31 = 885012207016: as C2 on sheet 2312_Puissance; Manufacturer Part Number: 885012207016; Category: Multilayer Ceramic Chip Capacitors; Match Code: WCAP-CSGP; ComponentLink1Description: Website Link; ComponentLink1URL: https://www.we-online.com/redexpert/article/885012207016?ad; ComponentLink2Description: Datasheet Link; ComponentLink2URL: https://www.we-online.com/redexpert/spec/885012207016?ad; Mount: Surface Mount; Operating Temperature Max: 125°C; Operating Temperature Min: -55°C; Packaging: Tape and Reel; Length: 2mm; Width: 1.25mm; Height: 0.8mm; Ceramic Type: X7R
D3 = MBR0580S1-7: as D1 on sheet 2312_Puissance; Digi-Key_Part_Number_3: MBR0580S1-7DIDKR-ND; Digi-Key_Part_Number_2: MBR0580S1-7DICT-ND; Digi-Key_Part_Number_1: MBR0580S1-7DITR-ND; RefDes: RefDes; Type: Type
D4-D6 = 150141M173100: WL-SFTW Full-color TOP LED Waterclear, size 3528, Red & Green & Blue, 120°; Manufacturer: Wurth Elektronik; Case/Size Code: 3528; Chip Technology: AlInGaP + InGaN; Dominant Wavelength (Blue): 470nm; Dominant Wavelength (Green): 520nm; Dominant Wavelength (Red): 625nm; Forward Voltage (Blue): 3.2V; Forward Voltage (Red): 2V; Luminous Intensity (Blue): 230mcd; Luminous Intensity (Green): 950mcd; Luminous Intensity (Red): 270mcd; Peak Wavelength (Blue): 465nm; Peak Wavelength (Green): 515nm; Peak Wavelength (Red): 635nm; Manufacturer Part Number: 150141M173100; Category: Signal LEDs; Match Code: WL-SFTW; ComponentLink1Description: Website Link; ComponentLink1URL: https://www.we-online.com/redexpert/article/150141M173100?ad; ComponentLink2Description: Datasheet Link; ComponentLink2URL: https://www.we-online.com/redexpert/spec/150141M173100?ad; Mount: Surface Mount; Operating Temperature Max: 85°C; Operating Temperature Min: -40°C; Packaging: Tape and Reel; Length: 3.5mm; Width: 2.8mm; Height: 1.9mm; Emitting Color: Red & Green & Blue; Forward Voltage (Green): 3.2V; Viewing Angle: 120°
D7 D8 = 150080SS75000: WL-SMCW Mono-color Chip LED Waterclear, size 0805, Super Red, 1.9V, 140°; Manufacturer: Wurth Elektronik; Case/Size Code: 0805; Chip Technology: AlInGaP; Dominant Wavelength: 630nm; Luminous Intensity: 60mcd; Peak Wavelength: 645nm; Manufacturer Part Number: 150080SS75000; Category: Signal LEDs; Match Code: WL-SMCW; ComponentLink1Description: Website Link; ComponentLink1URL: https://www.we-online.com/redexpert/article/150080SS75000?ad; ComponentLink2Description: Datasheet Link; ComponentLink2URL: https://www.we-online.com/redexpert/spec/150080SS75000?ad; Mount: Surface Mount; Operating Temperature Max: 85°C; Operating Temperature Min: -40°C; Packaging: Tape and Reel; Length: 2mm; Width: 1.25mm; Height: 0.7mm; Emitting Color: Super Red; Forward Voltage: 1.9V; Viewing Angle: 140°
LS1 = CMT-0904-83T: Buzzer Magnetic, 15Ω; Price: None; Value: *; Package: None; Availability: Unavailable; MP: CMT-0904-83T
Q3 = MMBTA06LT3G: as Q1 on sheet 2312_Puissance
R38 = RES-0805: SMD Resistor 0805, 0Ω
R39 = RES-0805: SMD Resistor 0805, 140Ω
R40 = RES-0805: SMD Resistor 0805, 10kΩ
R41-R43 = RES-0805: SMD Resistor 0805, 2.6kΩ
R44 R45 = RES-0805: SMD Resistor 0805, 330Ω
U4-U6 = TLC5973D: No Description Available; Mfr_Name: Texas Instruments; TYPE: TYPE; RefDes: RefDes

## Sheet 2312_Ethernet.SchDoc
size A3; Author: Miguel Santos; Organization: ETML-ES; Address1: Avenue Recordon 1; Address2: 1004 Lausanne; Address3: Switzerland; SheetNumber: 4; SheetTotal: 7; Version: 1.0; SPICEModelCacheRYIINKWG: <root> / <DocumentId>RYIINKWG</DocumentId> / </root>
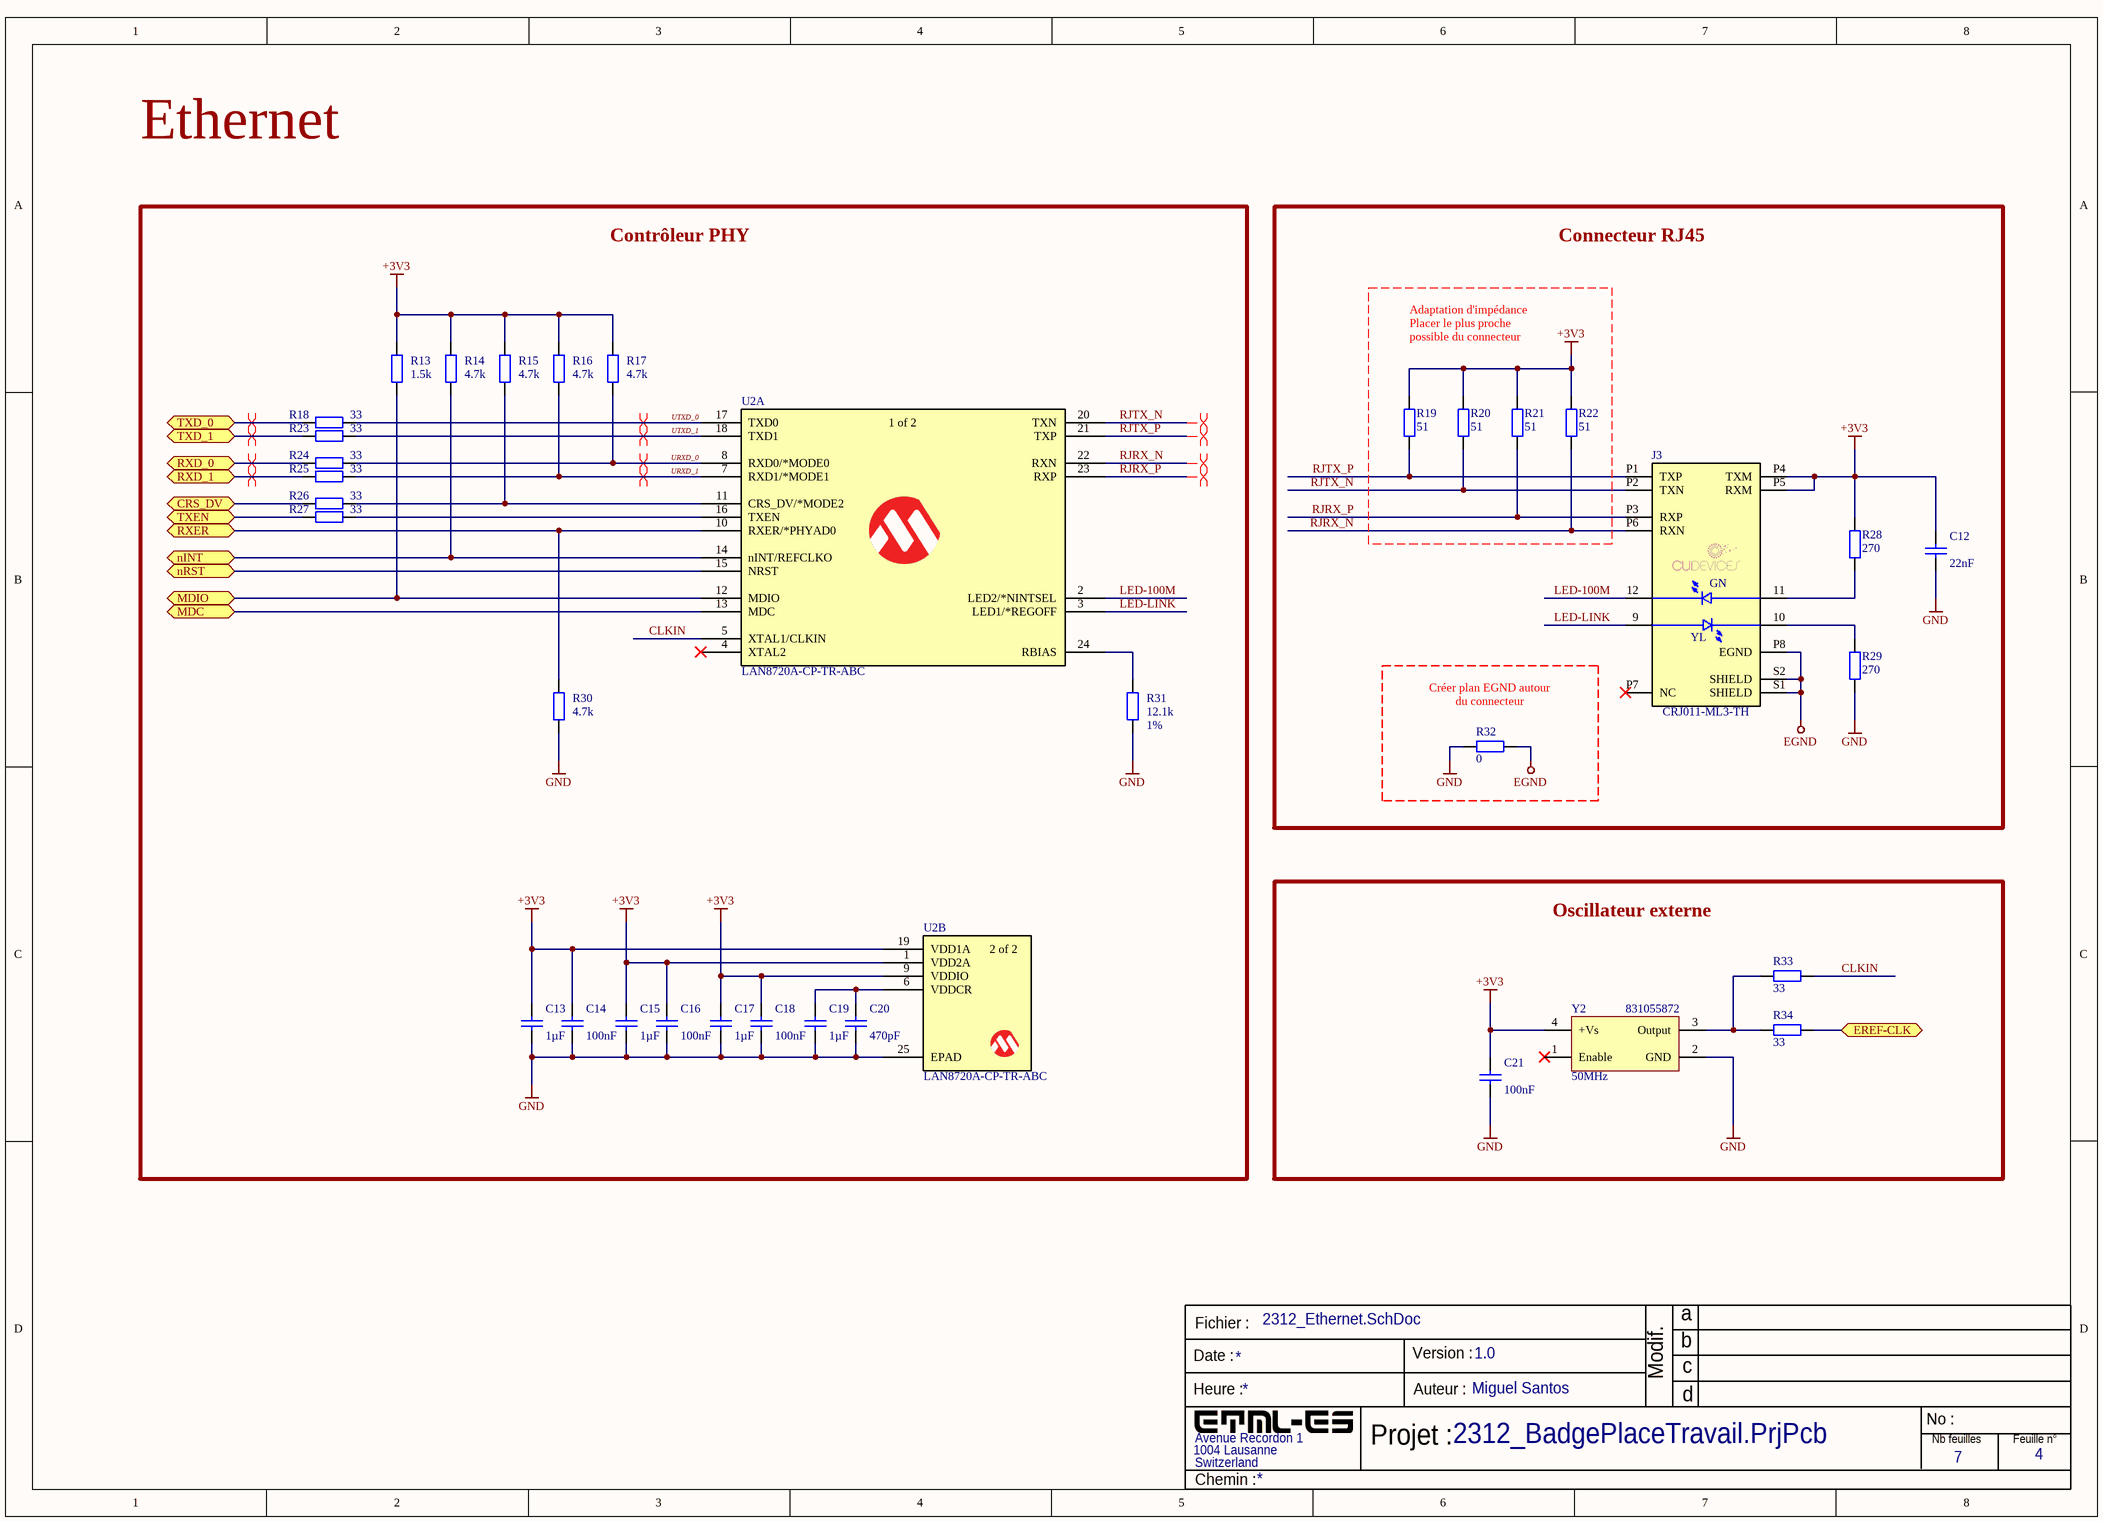
[diagram p4: 2312_Ethernet.SchDoc]

### Parts
C12  Capacitance: 22nF  [WCAP-CSGP_0805_L2W1.25H0.8_Reflow]  (hidden comment: 885012207013)
C13  Capacitance: 1µF  [WCAP-CSGP_0805_L2W1.25H1.25]  (hidden comment: 885012207022)
C14  Capacitance: 100nF  [WCAP-CSGP_0805_L2W1.25H0.8_Reflow]  (hidden comment: 885012207016)
C15  Capacitance: 1µF  [WCAP-CSGP_0805_L2W1.25H1.25]  (hidden comment: 885012207022)
C16  Capacitance: 100nF  [WCAP-CSGP_0805_L2W1.25H0.8_Reflow]  (hidden comment: 885012207016)
C17  Capacitance: 1µF  [WCAP-CSGP_0805_L2W1.25H1.25]  (hidden comment: 885012207022)
C18  Capacitance: 100nF  [WCAP-CSGP_0805_L2W1.25H0.8_Reflow]  (hidden comment: 885012207016)
C19  Capacitance: 1µF  [WCAP-CSGP_0805_L2W1.25H1.25]  (hidden comment: 885012207022)
C20  Capacitance: 470pF  [WCAP-CSGP_0805_L2W1.25H0.8_Reflow]  (hidden comment: 885012007007)
C21  Capacitance: 100nF  [WCAP-CSGP_0805_L2W1.25H0.8_Reflow]  (hidden comment: 885012207016)
J3  CRJ011-ML3-TH  [CUI_CRJ011-ML3-TH]
R13  Resistance: 1.5k  [2312-RES-0805]  (hidden comment: RES-0805)
R14  Resistance: 4.7k  [2312-RES-0805]  (hidden comment: RES-0805)
R15  Resistance: 4.7k  [2312-RES-0805]  (hidden comment: RES-0805)
R16  Resistance: 4.7k  [2312-RES-0805]  (hidden comment: RES-0805)
R17  Resistance: 4.7k  [2312-RES-0805]  (hidden comment: RES-0805)
R18  Resistance: 33  [2312-RES-0805]  (hidden comment: RES-0805)
R19  Resistance: 51  [2312-RES-0805]  (hidden comment: RES-0805)
R20  Resistance: 51  [2312-RES-0805]  (hidden comment: RES-0805)
R21  Resistance: 51  [2312-RES-0805]  (hidden comment: RES-0805)
R22  Resistance: 51  [2312-RES-0805]  (hidden comment: RES-0805)
R23  Resistance: 33  [2312-RES-0805]  (hidden comment: RES-0805)
R24  Resistance: 33  [2312-RES-0805]  (hidden comment: RES-0805)
R25  Resistance: 33  [2312-RES-0805]  (hidden comment: RES-0805)
R26  Resistance: 33  [2312-RES-0805]  (hidden comment: RES-0805)
R27  Resistance: 33  [2312-RES-0805]  (hidden comment: RES-0805)
R28  Resistance: 270  [2312-RES-0805]  (hidden comment: RES-0805)
R29  Resistance: 270  [2312-RES-0805]  (hidden comment: RES-0805)
R30  Resistance: 4.7k  [2312-RES-0805]  (hidden comment: RES-0805)
R31  Resistance: 12.1k  [2312-RES-0805]  (hidden comment: RES-0805)
R32  Resistance: 0  [2312-RES-0805]  (hidden comment: RES-0805)
R33  Resistance: 33  [2312-RES-0805]  (hidden comment: RES-0805)
R34  Resistance: 33  [2312-RES-0805]  (hidden comment: RES-0805)
U2  LAN8720A-CP-TR-ABC  [QFN24-6X6_MC_MCH]  (parts A,B of 2)
Y2  831055872  Frequency: 50MHz  [WE-SPXO_CFPS-39]

### Blocks framed on the sheet
Contrôleur PHY: C13-C20 R13-R18 R23-R27 R30 R31 U2
Connecteur RJ45: C12 J3 R19-R22 R28 R29 R32
Oscillateur externe: C21 R33 R34 Y2

### Ports
CRS_DV (bidir), EREF-CLK (bidir), MDC (bidir), MDIO (bidir), nINT (bidir), nRST (bidir), RXD_0 (bidir), RXD_1 (bidir), RXER (bidir), TXD_0 (bidir), TXD_1 (bidir), TXEN (bidir)

### Nets
+3V3: C12.2 C13.2 C14.2 C15.2 C16.2 C17.2 C18.2 C21.2 J3.P4(TXM) J3.P5(RXM) R13.2 R14.2 R15.2 R16.2 R17.2 R19.2 R20.2 R21.2 R22.2 R28.2 U2.1(VDD2A) U2.9(VDDIO) U2.19(VDD1A) Y2.4(+Vs)
EGND: J3.P8(EGND) J3.S1(SHIELD) J3.S2(SHIELD) R32.1
GND: C12.1 C13.1 C14.1 C15.1 C16.1 C17.1 C18.1 C19.1 C20.1 C21.1 R29.1 R30.1 R31.1 R32.2 U2.25(EPAD) Y2.2(GND)
CLKIN: R33.1 U2.5(XTAL1/CLKIN)
CRS_DV: R26.2 ; port CRS_DV
EMDC: U2.13(MDC) ; port MDC
EMDIO: R13.1 U2.12(MDIO) ; port MDIO
EREF-CLK: R34.1 ; port EREF-CLK
ERXD_0: R24.2 ; port RXD_0
ERXD_1: R25.2 ; port RXD_1
ERXERR: R30.2 U2.10(RXER/*PHYAD0) ; port RXER
ETXD_0: R18.2 ; port TXD_0
ETXD_1: R23.2 ; port TXD_1
ETXEN: R27.2 ; port TXEN
INT4: R14.1 U2.14(nINT/REFCLKO) ; port nINT
LED-100M: J3.12 U2.2(LED2/*NINTSEL)
LED-LINK: J3.9 U2.3(LED1/*REGOFF)
nRST: U2.15(NRST) ; port nRST
RJRX_N: J3.P6(RXN) R22.1 U2.22(RXN)
RJRX_P: J3.P3(RXP) R21.1 U2.23(RXP)
RJTX_N: J3.P2(TXN) R20.1 U2.20(TXN)
RJTX_P: J3.P1(TXP) R19.1 U2.21(TXP)
URXD_0: R17.1 R24.1 U2.8(RXD0/*MODE0)
URXD_1: R16.1 R25.1 U2.7(RXD1/*MODE1)
UTXD_0: R18.1 U2.17(TXD0)
UTXD_1: R23.1 U2.18(TXD1)
NetC19_2: C19.2 C20.2 U2.6(VDDCR)
NetJ3_10: J3.10 R29.2
NetJ3_11: J3.11 R28.1
NetR15_1: R15.1 R26.1 U2.11(CRS_DV/*MODE2)
NetR27_1: R27.1 U2.16(TXEN)
NetR31_2: R31.2 U2.24(RBIAS)
NetR33_2: R33.2 R34.2 Y2.3(Output)

Not connected (* = marked no-connect by the designer): J3 P7(NC)*; U2 4(XTAL2)*; Y2 1(Enable)*

### Layout directives
differential pair: ERXD_0, ERXD_1, ETXD_0, ETXD_1, RJRX_N, RJRX_P, RJTX_N, RJTX_P, URXD_0, URXD_1, UTXD_0, UTXD_1

### Notes on the sheet
- Ethernet
- Adaptation d'impédance
  Placer le plus proche possible du connecteur
- (near R31) 1%
- (near R32) Créer plan EGND autour du connecteur
- Fichier :
- a
- Date :
- Heure :
- Version :
- Auteur :
- Modif.
- b
- c
- d
- Projet :
- No :
- Nb feuilles
- Feuille n°
- Chemin :
- (in symbol CRJ011-ML3-TH) GN; YL
- (in symbol LAN8720A-CP-TR-ABC, part A) 1 of 2
- (in symbol LAN8720A-CP-TR-ABC, part B) 2 of 2

### Library data of the parts
C12 = 885012207013: WCAP-CSGP Multilayer Ceramic Chip Capacitor, General Purpose, size 0805, X7R, 22nF, 10VDC; Manufacturer: Wurth Elektronik; Case/Size Code: 0805; Capacitance Tolerance: +/-10%; Dissipation Factor: 5%; Insulation Resistance: 10GΩ; Rated Voltage (DC): 10V; Technical Reference: X7R0805223K010DFCT10000; Manufacturer Part Number: 885012207013; Category: Multilayer Ceramic Chip Capacitors; Match Code: WCAP-CSGP; ComponentLink1Description: Website Link; ComponentLink1URL: https://www.we-online.com/redexpert/article/885012207013?ad; ComponentLink2Description: Datasheet Link; ComponentLink2URL: https://www.we-online.com/redexpert/spec/885012207013?ad; Mount: Surface Mount; Operating Temperature Max: 125°C; Operating Temperature Min: -55°C; Packaging: Tape and Reel; Length: 2mm; Width: 1.25mm; Height: 0.8mm; Ceramic Type: X7R
C13 C15 C17 C19 = 885012207022: WCAP-CSGP Multilayer Ceramic Chip Capacitor, General Purpose, size 0805, X7R, 1µF, 10VDC; Manufacturer: Wurth Elektronik; Case/Size Code: 0805; Capacitance Tolerance: +/-10%; Dissipation Factor: 5%; Insulation Resistance: 0.5GΩ; Rated Voltage (DC): 10V; Technical Reference: X7R0805105K010DFCT10000; Manufacturer Part Number: 885012207022; Category: Multilayer Ceramic Chip Capacitors; Match Code: WCAP-CSGP; ComponentLink1Description: Website Link; ComponentLink1URL: https://www.we-online.com/redexpert/article/885012207022?ad; ComponentLink2Description: Datasheet Link; ComponentLink2URL: https://www.we-online.com/redexpert/spec/885012207022?ad; Mount: Surface Mount; Operating Temperature Max: 125°C; Operating Temperature Min: -55°C; Packaging: Tape and Reel; Length: 2mm; Width: 1.25mm; Height: 1.25mm; Ceramic Type: X7R
C14 C16 C18 C21 = 885012207016: as C2 on sheet 2312_Puissance; Manufacturer Part Number: 885012207016; Category: Multilayer Ceramic Chip Capacitors; Match Code: WCAP-CSGP; ComponentLink1Description: Website Link; ComponentLink1URL: https://www.we-online.com/redexpert/article/885012207016?ad; ComponentLink2Description: Datasheet Link; ComponentLink2URL: https://www.we-online.com/redexpert/spec/885012207016?ad; Mount: Surface Mount; Operating Temperature Max: 125°C; Operating Temperature Min: -55°C; Packaging: Tape and Reel; Length: 2mm; Width: 1.25mm; Height: 0.8mm; Ceramic Type: X7R
C20 = 885012007007: WCAP-CSGP Multilayer Ceramic Chip Capacitor, General Purpose, size 0805, NP0, 470pF, 10VDC; Manufacturer: Wurth Elektronik; Case/Size Code: 0805; Capacitance Tolerance: +/-5%; Insulation Resistance: 10GΩ; Q Factor: 1000; Rated Voltage (DC): 10V; Technical Reference: NP00805471J010DFCT10000; Manufacturer Part Number: 885012007007; Category: Multilayer Ceramic Chip Capacitors; Match Code: WCAP-CSGP; ComponentLink1Description: Website Link; ComponentLink1URL: https://www.we-online.com/redexpert/article/885012007007?ad; ComponentLink2Description: Datasheet Link; ComponentLink2URL: https://www.we-online.com/redexpert/spec/885012007007?ad; Mount: Surface Mount; Operating Temperature Max: 125°C; Operating Temperature Min: -55°C; Packaging: Tape and Reel; Length: 2mm; Width: 1.25mm; Height: 0.8mm; Ceramic Type: NP0
J3 = CRJ011-ML3-TH: Modular Jack; Availability: Unavailable; Package: None; Price: None; MP: CRJ011-ML3-TH; Value: *
R13 = RES-0805: SMD Resistor 0805, 1.5kΩ
R14-R17 R30 = RES-0805: SMD Resistor 0805, 4.7kΩ
R18 R23-R27 R33 R34 = RES-0805: SMD Resistor 0805, 33Ω
R19-R22 = RES-0805: SMD Resistor 0805, 51Ω
R28 R29 = RES-0805: SMD Resistor 0805, 270Ω
R31 = RES-0805: SMD Resistor 0805, 12.1kΩ
R32 = RES-0805: SMD Resistor 0805, 0Ω
U2 = LAN8720A-CP-TR-ABC: No Description Available; Mfr_Name: Microchip; Digi-Key_Part_Number_3: LAN8720A-CP-TR-ABCTR-ND; Digi-Key_Part_Number_2: LAN8720A-CP-TR-ABCDKR-ND; Digi-Key_Part_Number_1: LAN8720A-CP-TR-ABCCT-ND; RefDes: RefDes; Type: Type
Y2 = 831055872: WE-SPXO Simple Packaged Quartz Oscillator, SMT, CFPS-39, 50MHz, 3.3V; Manufacturer: Wurth Elektronik; Frequency Stability: +/-25ppm; ComponentLink1Description: Website Link; ComponentLink1URL: https://www.we-online.com/redexpert/article/831055872?ad; ComponentLink2Description: Datasheet Link; ComponentLink2URL: https://www.we-online.com/redexpert/spec/831055872?ad; Manufacturer Part Number: 831055872; Category: Oscillators; Match Code: WE-SPXO; Mount: Surface Mount; Operating Temperature Max: 85°C; Operating Temperature Min: -40°C; Packaging: Tape and Reel; Case/Size Code: CFPS-39; Length: 3.2mm; Width: 2.5mm; Height: 1.2mm; Supply Voltage: 3.3V

## Sheet 2312_RFID.SchDoc
size A3; Author: Miguel Santos; Organization: ETML-ES; Address1: Avenue Recordon 1; Address2: 1004 Lausanne; Address3: Switzerland; SheetNumber: 6; SheetTotal: 7; Version: 1.0
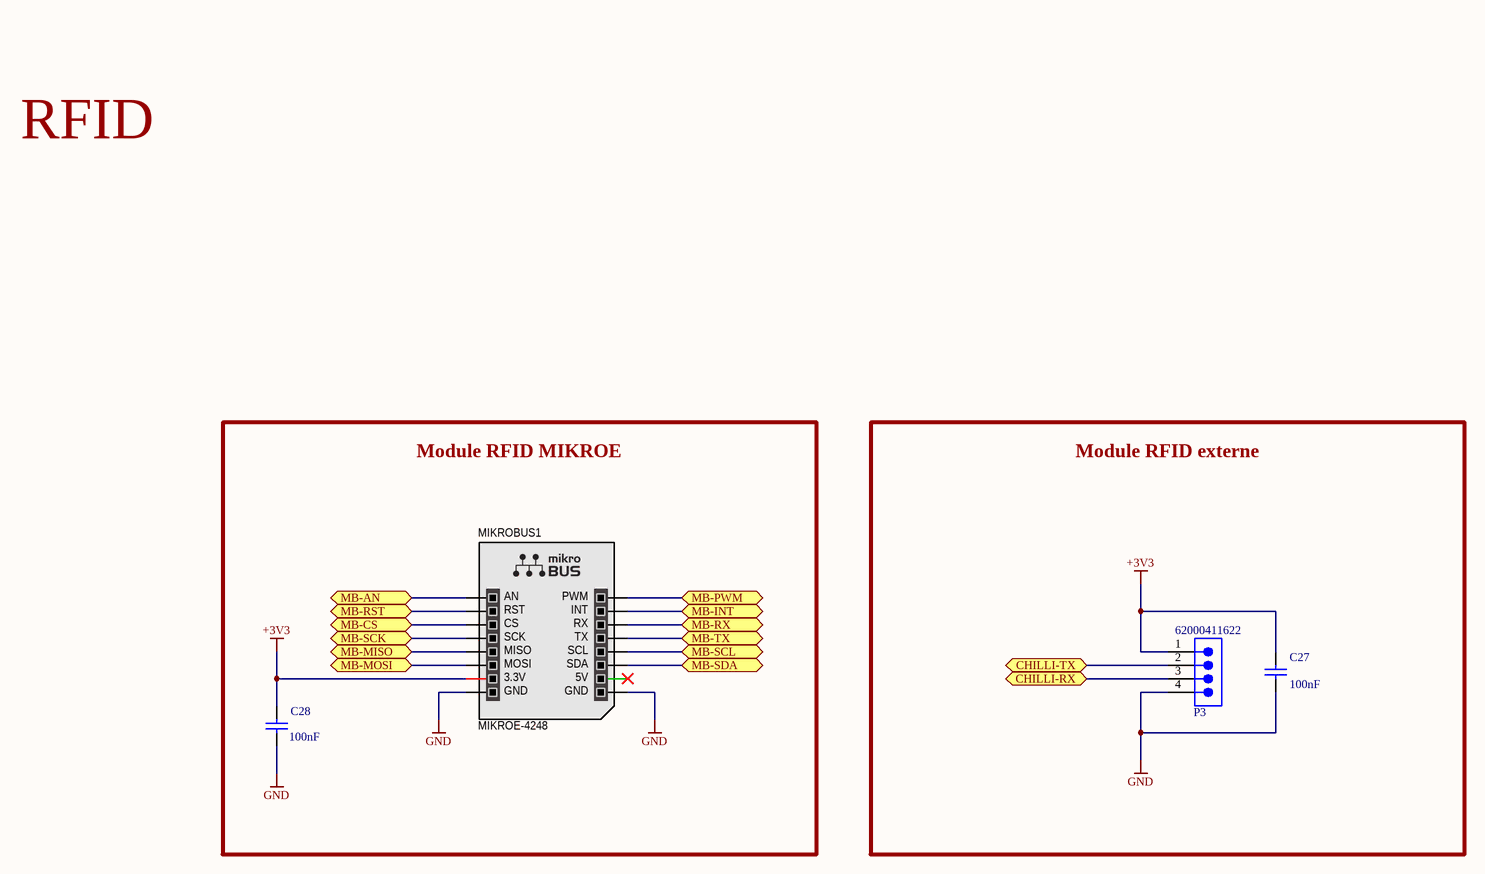
[diagram p5: 2312_RFID.SchDoc]

### Parts
C27  Capacitance: 100nF  [WCAP-CSGP_0805_L2W1.25H0.8_Reflow]  (hidden comment: 885012207016)
C28  Capacitance: 100nF  [WCAP-CSGP_0805_L2W1.25H0.8_Reflow]  (hidden comment: 885012207016)
MIKROBUS1  MIKROE-4248  [MIKROBUS HOST SMD 16 - Black]
P3  62000411622  [62000411622]

### Blocks framed on the sheet
Module RFID MIKROE: C28 MIKROBUS1
Module RFID externe: C27 P3

### Ports
CHILLI-RX (bidir), CHILLI-TX (bidir), MB-AN (bidir), MB-CS (bidir), MB-INT (bidir), MB-MISO (bidir), MB-MOSI (bidir), MB-PWM (bidir), MB-RST (bidir), MB-RX (bidir), MB-SCK (bidir), MB-SCL (bidir), MB-SDA (bidir), MB-TX (bidir)

### Nets
+3V3: C27.2 C28.2 MIKROBUS1.7(3.3V) P3.1
GND: C27.1 C28.1 MIKROBUS1.8(GND) MIKROBUS1.9(GND) P3.4
CHILLI-RX: P3.3 ; port CHILLI-RX
CHILLI-TX: P3.2 ; port CHILLI-TX
MB-AN: MIKROBUS1.1(AN) ; port MB-AN
MB-CS: MIKROBUS1.3(CS) ; port MB-CS
MB-INT: MIKROBUS1.15(INT) ; port MB-INT
MB-MISO: MIKROBUS1.5(MISO) ; port MB-MISO
MB-MOSI: MIKROBUS1.6(MOSI) ; port MB-MOSI
MB-PWM: MIKROBUS1.16(PWM) ; port MB-PWM
MB-RST: MIKROBUS1.2(RST) ; port MB-RST
MB-RX: MIKROBUS1.14(RX) ; port MB-RX
MB-SCK: MIKROBUS1.4(SCK) ; port MB-SCK
MB-SCL: MIKROBUS1.12(SCL) ; port MB-SCL
MB-SDA: MIKROBUS1.11(SDA) ; port MB-SDA
MB-TX: MIKROBUS1.13(TX) ; port MB-TX

Not connected (* = marked no-connect by the designer): MIKROBUS1 10(5V)*

### Notes on the sheet
- RFID
- Fichier :
- a
- Date :
- Heure :
- Version :
- Auteur :
- Modif.
- b
- c
- d
- Projet :
- No :
- Nb feuilles
- Feuille n°
- Chemin :

### Library data of the parts
C27 C28 = 885012207016: as C2 on sheet 2312_Puissance; Manufacturer Part Number: 885012207016; Category: Multilayer Ceramic Chip Capacitors; Match Code: WCAP-CSGP; ComponentLink1Description: Website Link; ComponentLink1URL: https://www.we-online.com/redexpert/article/885012207016?ad; ComponentLink2Description: Datasheet Link; ComponentLink2URL: https://www.we-online.com/redexpert/spec/885012207016?ad; Mount: Surface Mount; Operating Temperature Max: 125°C; Operating Temperature Min: -55°C; Packaging: Tape and Reel; Length: 2mm; Width: 1.25mm; Height: 0.8mm; Ceramic Type: X7R
MIKROBUS1 = MIKROBUS HOST CONN: mikroBUS socket
P3 = 62000411622: WR-WTB Male Vertical Shrouded Header, pitch 2mm, 4pins; Manufacturer: Wurth Elektronik; Contact Resistance: 20mΩ; Rated Current: 2A; Working Voltage: 125VAC; Withstanding Voltage: 800VAC; ComponentLink1Description: Website Link; ComponentLink1URL: https://www.we-online.com/redexpert/article/62000411622?ad; ComponentLink2Description: Datasheet Link; ComponentLink2URL: https://www.we-online.com/redexpert/spec/62000411622?ad; Manufacturer Part Number: 62000411622; Category: Wire-to-Board Connectors; Match Code: WR-WTB; Mount: Through Hole; Operating Temperature Max: 85°C; Operating Temperature Min: -25°C; Packaging: Bag; Length: 10mm; Width: 4.7mm; Height: 6.1mm; Gender: Male; Number of Pins: 4; Number of Rows: 1; Orientation: Vertical; Pitch: 2mm

## Sheet 2312_ESP32.SchDoc
size A3; Author: Miguel Santos; Organization: ETML-ES; Address1: Avenue Recordon 1; Address2: 1004 Lausanne; Address3: Switzerland; SheetNumber: 5; SheetTotal: 7; Version: 1.0
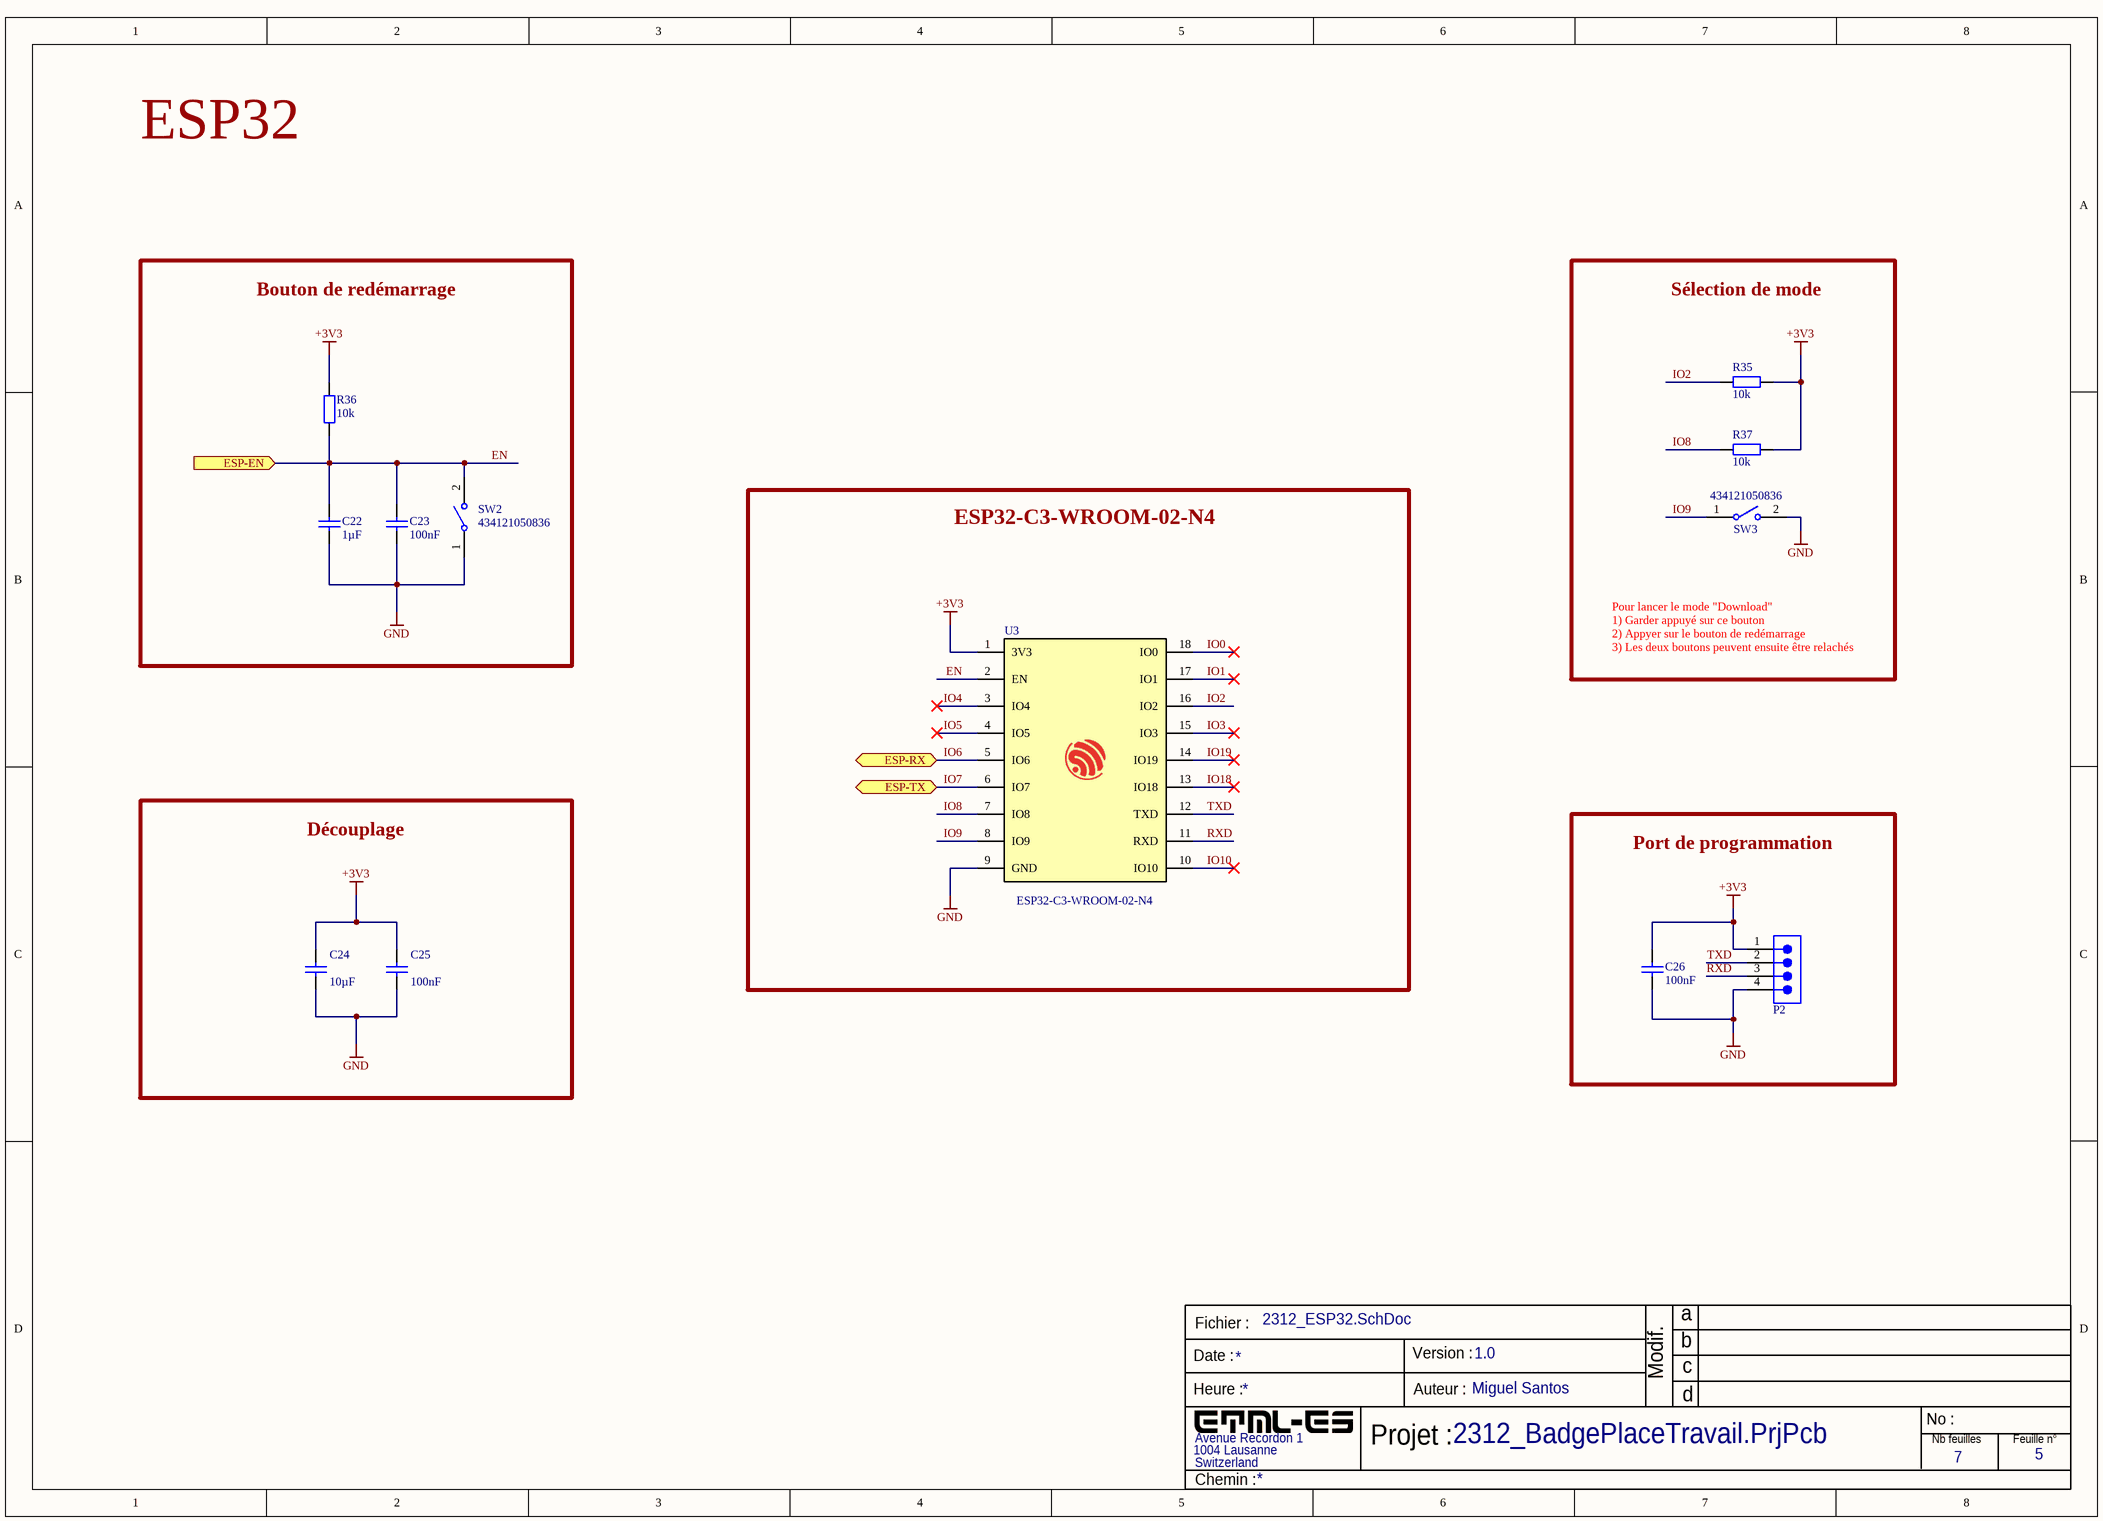
[diagram p6: 2312_ESP32.SchDoc]

### Parts
C22  Capacitance: 1µF  [WCAP-CSGP_0805_L2W1.25H1.25]  (hidden comment: 885012207022)
C23  Capacitance: 100nF  [WCAP-CSGP_0805_L2W1.25H0.8_Reflow]  (hidden comment: 885012207016)
C24  Capacitance: 10µF  [WCAP-CSGP_0805_L2W1.25H1.25]  (hidden comment: 885012107004)
C25  Capacitance: 100nF  [WCAP-CSGP_0805_L2W1.25H0.8_Reflow]  (hidden comment: 885012207016)
C26  Capacitance: 100nF  [WCAP-CSGP_0805_L2W1.25H0.8_Reflow]  (hidden comment: 885012207016)
P2  61300411121  [61300411121]  (value not drawn)
R35  Resistance: 10k  [2312-RES-0805]  (hidden comment: RES-0805)
R36  Resistance: 10k  [2312-RES-0805]  (hidden comment: RES-0805)
R37  Resistance: 10k  [2312-RES-0805]  (hidden comment: RES-0805)
SW2  434121050836  [WS-TASV_L6W3.5H5_4341x10508x6]
SW3  434121050836  [WS-TASV_L6W3.5H5_4341x10508x6]
U3  ESP32-C3-WROOM-02-N4  [ESP32C3WROOM02N4]

### Blocks framed on the sheet
Bouton de redémarrage: C22 C23 R36 SW2
Sélection de mode: R35 R37 SW3
ESP32-C3-WROOM-02-N4: U3
Découplage: C24 C25
Port de programmation: C26 P2

### Ports
ESP-EN (in), ESP-RX (bidir), ESP-TX (bidir)

### Nets
+3V3: C24.2 C25.2 C26.2 P2.1 R35.1 R36.1 R37.2 U3.1(3V3)
GND: C22.1 C23.2 C24.1 C25.1 C26.1 P2.4 SW2.1 SW3.2 U3.9(GND)
EN: C22.2 C23.1 R36.2 SW2.2 U3.2(EN) ; port ESP-EN
IO0: U3.18(IO0)
IO1: U3.17(IO1)
IO2: R35.2 U3.16(IO2)
IO3: U3.15(IO3)
IO4: U3.3(IO4)
IO5: U3.4(IO5)
IO6: U3.5(IO6) ; port ESP-RX
IO7: U3.6(IO7) ; port ESP-TX
IO8: R37.1 U3.7(IO8)
IO9: SW3.1 U3.8(IO9)
IO10: U3.10(IO10)
IO18: U3.13(IO18)
IO19: U3.14(IO19)
RXD: P2.3 U3.11(RXD)
TXD: P2.2 U3.12(TXD)

### Notes on the sheet
- ESP32
- Pour lancer le mode "Download"
  1) Garder appuyé sur ce bouton
  2) Appyer sur le bouton de redémarrage
  3) Les deux boutons peuvent ensuite être relachés
- Fichier :
- a
- Date :
- Heure :
- Version :
- Auteur :
- Modif.
- b
- c
- d
- Projet :
- No :
- Nb feuilles
- Feuille n°
- Chemin :

### Library data of the parts
C22 = 885012207022: as C13 on sheet 2312_Ethernet; Manufacturer Part Number: 885012207022; Category: Multilayer Ceramic Chip Capacitors; Match Code: WCAP-CSGP; ComponentLink1Description: Website Link; ComponentLink1URL: https://www.we-online.com/redexpert/article/885012207022?ad; ComponentLink2Description: Datasheet Link; ComponentLink2URL: https://www.we-online.com/redexpert/spec/885012207022?ad; Mount: Surface Mount; Operating Temperature Max: 125°C; Operating Temperature Min: -55°C; Packaging: Tape and Reel; Length: 2mm; Width: 1.25mm; Height: 1.25mm; Ceramic Type: X7R
C23 C25 C26 = 885012207016: as C2 on sheet 2312_Puissance; Manufacturer Part Number: 885012207016; Category: Multilayer Ceramic Chip Capacitors; Match Code: WCAP-CSGP; ComponentLink1Description: Website Link; ComponentLink1URL: https://www.we-online.com/redexpert/article/885012207016?ad; ComponentLink2Description: Datasheet Link; ComponentLink2URL: https://www.we-online.com/redexpert/spec/885012207016?ad; Mount: Surface Mount; Operating Temperature Max: 125°C; Operating Temperature Min: -55°C; Packaging: Tape and Reel; Length: 2mm; Width: 1.25mm; Height: 0.8mm; Ceramic Type: X7R
C24 = 885012107004: WCAP-CSGP Multilayer Ceramic Chip Capacitor, General Purpose, size 0805, X5R, 10µF, 6.3VDC; Manufacturer: Wurth Elektronik; Case/Size Code: 0805; Capacitance Tolerance: +/-20%; Dissipation Factor: 15%; Insulation Resistance: 0.01GΩ; Rated Voltage (DC): 6.3V; Technical Reference: X5R0805106M6R3DFCT10000; Manufacturer Part Number: 885012107004; Category: Multilayer Ceramic Chip Capacitors; Match Code: WCAP-CSGP; ComponentLink1Description: Website Link; ComponentLink1URL: https://www.we-online.com/redexpert/article/885012107004?ad; ComponentLink2Description: Datasheet Link; ComponentLink2URL: https://www.we-online.com/redexpert/spec/885012107004?ad; Mount: Surface Mount; Operating Temperature Max: 85°C; Operating Temperature Min: -55°C; Packaging: Tape and Reel; Length: 2mm; Width: 1.25mm; Height: 1.25mm; Ceramic Type: X5R
P2 = 61300411121: as P7 on sheet 2312_SchemaBloc; ComponentLink1Description: Website Link; ComponentLink1URL: https://www.we-online.com/redexpert/article/61300411121?ad; ComponentLink2Description: Datasheet Link; ComponentLink2URL: https://www.we-online.com/redexpert/spec/61300411121?ad; Manufacturer Part Number: 61300411121; Category: Board-to-Board Connectors; Match Code: WR-PHD; Mount: Through Hole; Operating Temperature Max: 105°C; Operating Temperature Min: -40°C; Packaging: Bag; Gender: Pin Header; Number of Pins: 4; Number of Rows: 1; Orientation: Vertical; Pitch: 2.54mm
R35-R37 = RES-0805: SMD Resistor 0805, 10kΩ
SW2 SW3 = 434121050836: as SW1 on sheet 2312_PIC32; Manufacturer Part Number: 434121050836; Category: Tact Switches; Match Code: WS-TASV; ComponentLink1Description: Website Link; ComponentLink1URL: https://www.we-online.com/redexpert/article/434121050836?ad; ComponentLink2Description: Datasheet Link; ComponentLink2URL: https://www.we-online.com/redexpert/spec/434121050836?ad; Mount: Surface Mount; Operating Temperature Max: 85°C; Operating Temperature Min: -40°C; Packaging: Tape and Reel; Length: 6mm; Width: 3.5mm; Height: 5mm; Circuit: SPST-NO; Contact Material: Stainless Steel; Contact Plating: Silver; Operation Force: 360g; Rated Current: 50mA; Rated Voltage (DC): 12V; Terminal Material: Copper Alloy; Terminal Plating: Silver
U3 = ESP32-C3-WROOM-02-N4: WiFi Modules (802.11) (Engineering Samples) SMD module, ESP32-C3, 4MB SPI flash, PCB antenna, -40 C +85 C; Manufacturer_Name: Espressif Systems; Geometry.Height: 3.35mm; Manufacturer_Part_Number: ESP32-C3-WROOM-02-N4; Mouser Part Number: 356-ESP32C3WROOM02N4; Mouser Price/Stock: https://www.mouser.co.uk/ProductDetail/Espressif-Systems/ESP32-C3-WROOM-02-N4?qs=stqOd1AaK7%2FqjTZKEOgfUg%3D%3D; Arrow Part Number: *; Arrow Price/Stock: *; Datasheet Link: https://www.mouser.ch/datasheet/2/891/Espressif_ESP32_C3_WROOM_02-2006871.pdf